# EAGLE design light_controller (EAGLE 8.5.0)
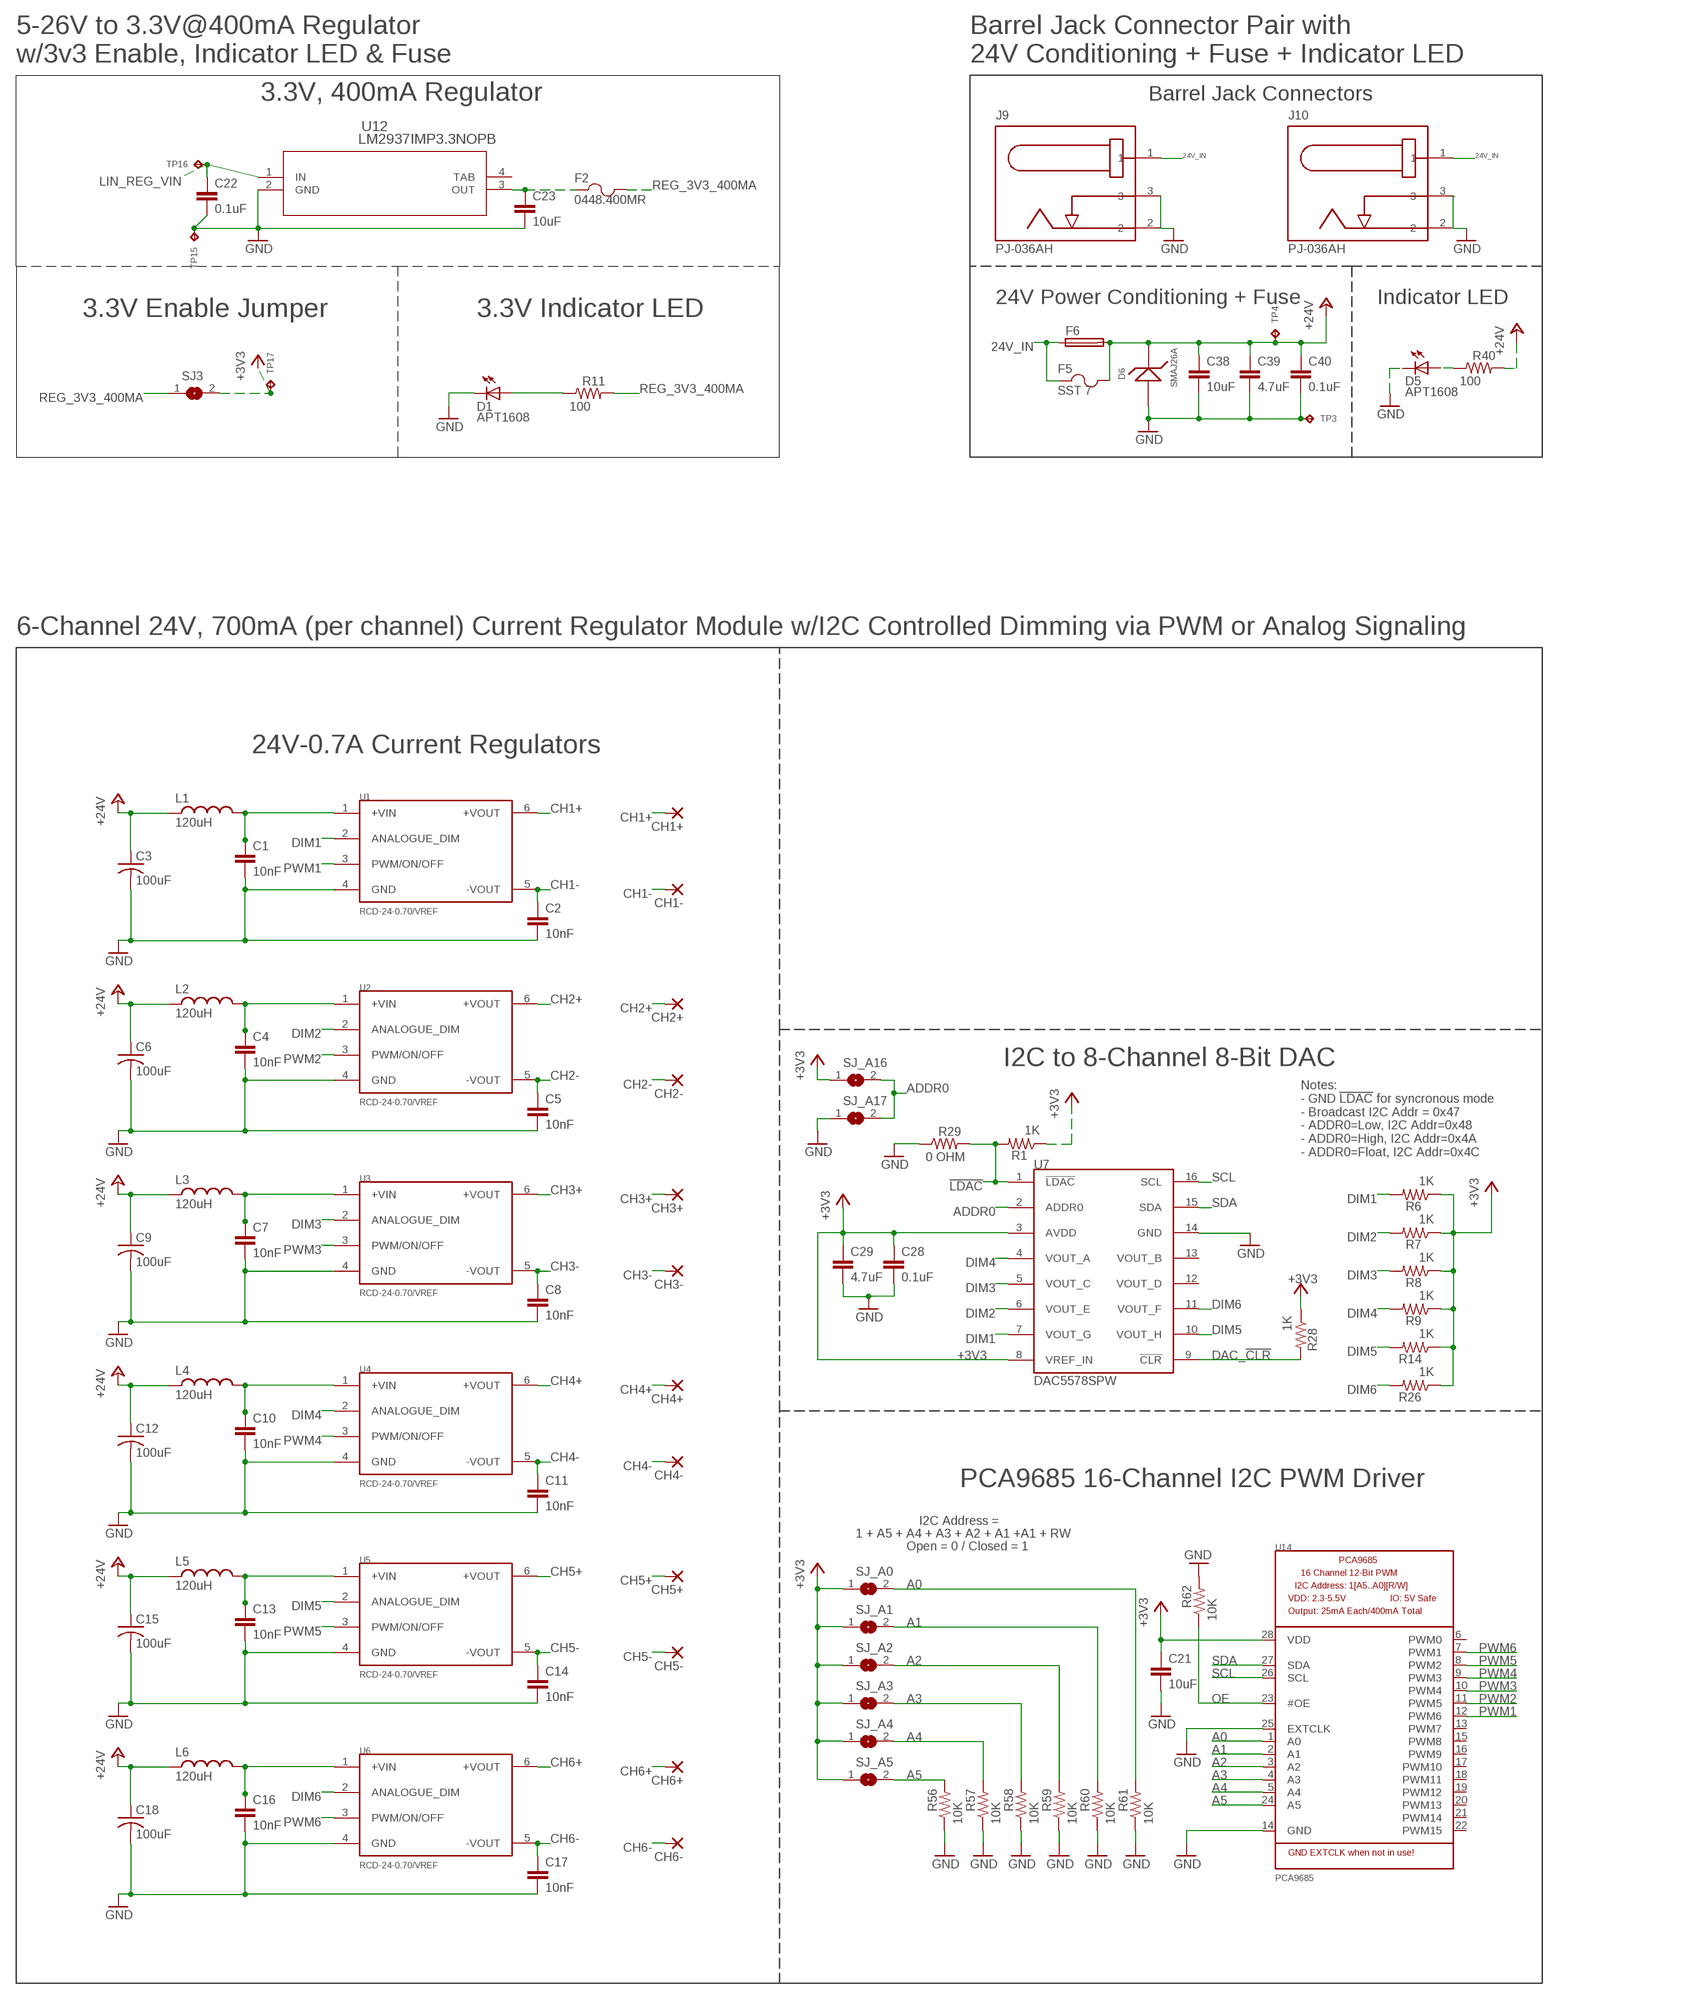
[diagram p0: schematic, sheet 1, part 1 of 2]
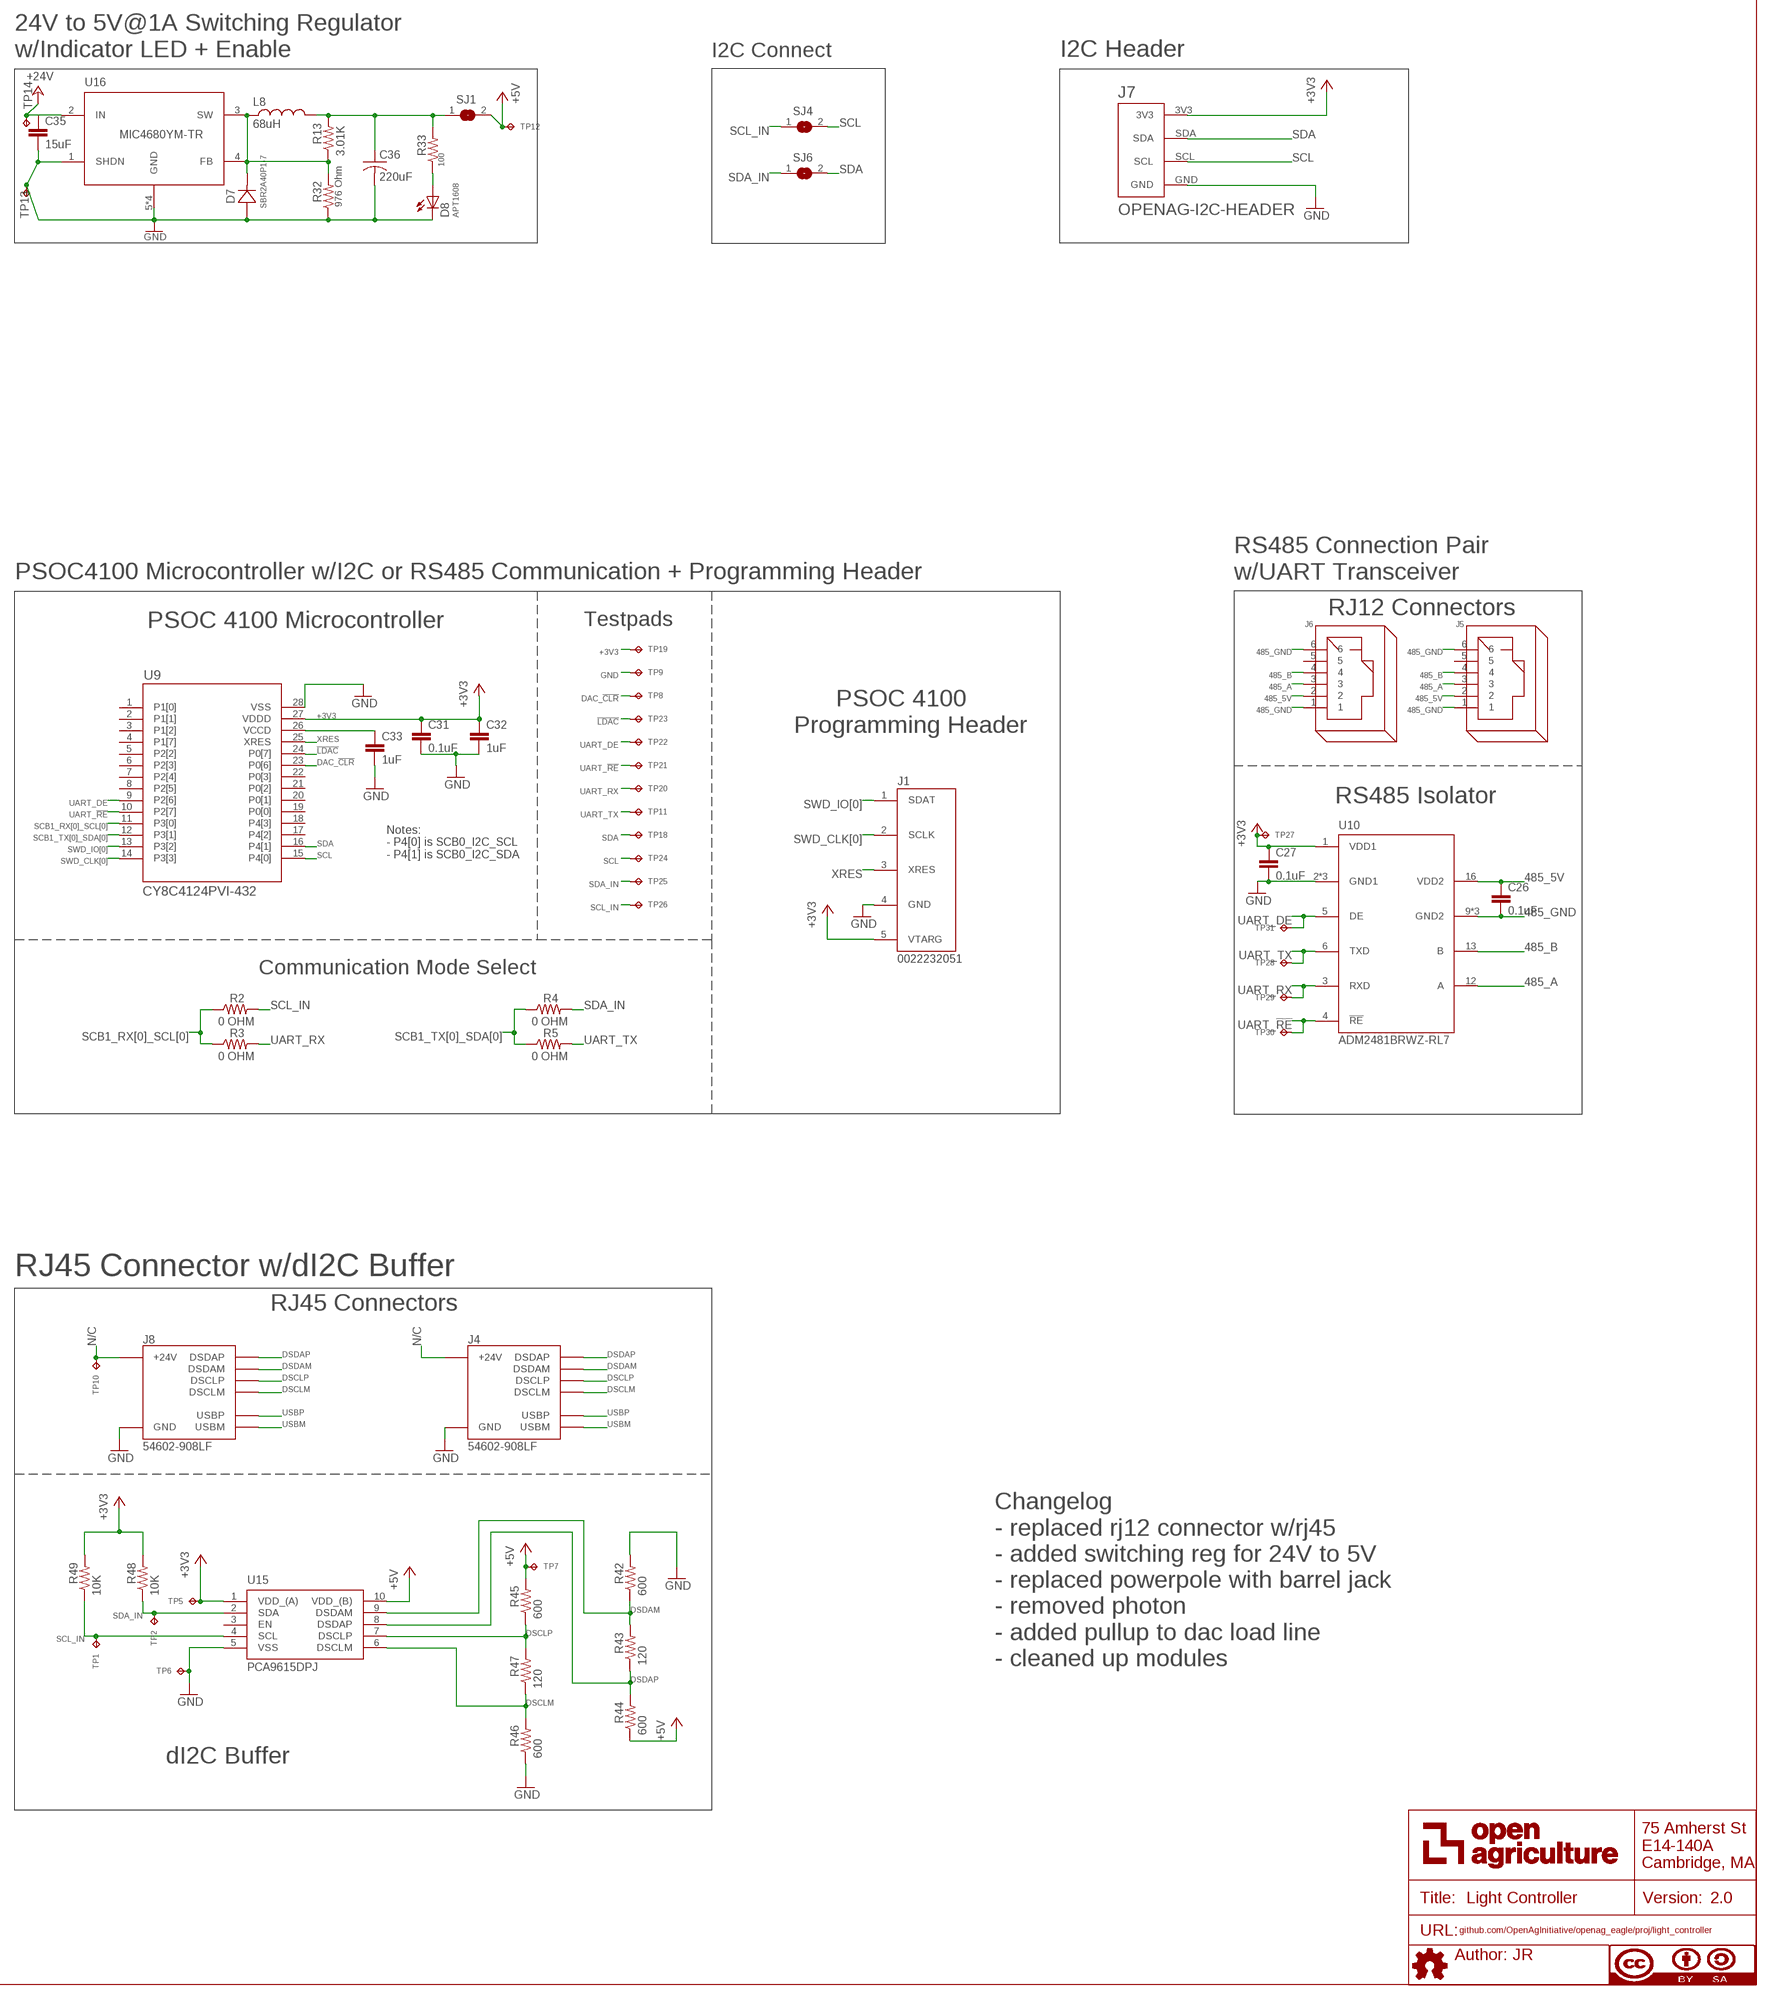
[diagram p1: schematic, sheet 1, part 2 of 2]

## Parts
C1  10nF  10NF-C0603C103K5RACTU  [C0603]
C2  10nF  10NF-C0603C103K5RACTU  [C0603]
C3  100uF  100UF-EEE-1HA101UP  [EEE-1HA101UP]
C4  10nF  10NF-C0603C103K5RACTU  [C0603]
C5  10nF  10NF-C0603C103K5RACTU  [C0603]
C6  100uF  100UF-EEE-1HA101UP  [EEE-1HA101UP]
C7  10nF  10NF-C0603C103K5RACTU  [C0603]
C8  10nF  10NF-C0603C103K5RACTU  [C0603]
C9  100uF  100UF-EEE-1HA101UP  [EEE-1HA101UP]
C10  10nF  10NF-C0603C103K5RACTU  [C0603]
C11  10nF  10NF-C0603C103K5RACTU  [C0603]
C12  100uF  100UF-EEE-1HA101UP  [EEE-1HA101UP]
C13  10nF  10NF-C0603C103K5RACTU  [C0603]
C14  10nF  10NF-C0603C103K5RACTU  [C0603]
C15  100uF  100UF-EEE-1HA101UP  [EEE-1HA101UP]
C16  10nF  10NF-C0603C103K5RACTU  [C0603]
C17  10nF  10NF-C0603C103K5RACTU  [C0603]
C18  100uF  100UF-EEE-1HA101UP  [EEE-1HA101UP]
C21  10uF  10UF-GMK212BBJ106KG-T  [C0805]
C22  0.1uF  0.1UF-C0603C104K5RACTU  [C0603]
C23  10uF  10UF-GMK212BBJ106KG-T  [C0805]
C26  0.1uF  0.1UF-C0603C104K5RACTU  [C0603]
C27  0.1uF  0.1UF-C0603C104K5RACTU  [C0603]
C28  0.1uF  0.1UF-C0603C104K5RACTU  [C0603]
C29  4.7uF  4.7UF-CL21A475KBQNNNE  [C0805]
C31  0.1uF  0.1UF-C0603C104K5RACTU  [C0603]
C32  1uF  1UF-CL10A105KB8NNNC  [C0603]
C33  1uF  1UF-CL10A105KB8NNNC  [C0603]
C35  15uF  15UF-C2012X5R1V156M125AC  [C0805]
C36  220uF  220UF-TPSY227K010R0100  [CT7343]
C38  10uF  10UF-GMK212BBJ106KG-T  [C0805]
C39  4.7uF  4.7UF-CL21A475KBQNNNE  [C0805]
C40  0.1uF  0.1UF-C0603C104K5RACTU  [C0603]
CH1+  3,17/1,3  [3,17/1,3]
CH1-  3,17/1,3  [3,17/1,3]
CH2+  3,17/1,3  [3,17/1,3]
CH2-  3,17/1,3  [3,17/1,3]
CH3+  3,17/1,3  [3,17/1,3]
CH3-  3,17/1,3  [3,17/1,3]
CH4+  3,17/1,3  [3,17/1,3]
CH4-  3,17/1,3  [3,17/1,3]
CH5+  3,17/1,3  [3,17/1,3]
CH5-  3,17/1,3  [3,17/1,3]
CH6+  3,17/1,3  [3,17/1,3]
CH6-  3,17/1,3  [3,17/1,3]
D1  APT1608  APT1608CGCK  [CHIPLED_0603]
D5  APT1608  APT1608CGCK  [CHIPLED_0603]
D6  SMAJ26A  SMAJ26A-13-F  [SMA]
D7  SBR2A40P1-7  [POWERDI123]
D8  APT1608  APT1608CGCK  [CHIPLED_0603]
F2  0448.400MR  0438.375WR  [0603]
F5  SST 7  SST_7  [SS]
F6  GSH15  [GSH15]
FRAME1  DOCFIELD  [DOCFIELD]
J1  0022232051  MINI-PROG3-5POS-MATING-CONNECTOR  [22-23-2051]
J4  54602-908LF  OPENAG-V1-RJ45PTH  [OPENAG-V1-RJ45]
J5  OPENAG-RS485-RJ12  [OPENAG-RS485-RJ12]
J6  OPENAG-RS485-RJ12  [OPENAG-RS485-RJ12]
J7  OPENAG-I2C-HEADER  [OPENAG-I2C-HEADER]
J8  54602-908LF  OPENAG-V1-RJ45PTH  [OPENAG-V1-RJ45]
J9  PJ-036AH  PJ-036AH-SMT-TR  [PJ-036AH]
J10  PJ-036AH  PJ-036AH-SMT-TR  [PJ-036AH]
L1  120uH  120UH-74404064121  [74404064121]
L2  120uH  120UH-74404064121  [74404064121]
L3  120uH  120UH-74404064121  [74404064121]
L4  120uH  120UH-74404064121  [74404064121]
L5  120uH  120UH-74404064121  [74404064121]
L6  120uH  120UH-74404064121  [74404064121]
L8  68uH  68UH-UP2B-680-R  [UP2B]
R1  1K  1K-ERJ-PB3D1001V  [RC0603N]
R2  0 OHM  0OHM-RC0603JR-070RL  [RC0603N]
R3  0 OHM  0OHM-RC0603JR-070RL  [RC0603N]
R4  0 OHM  0OHM-RC0603JR-070RL  [RC0603N]
R5  0 OHM  0OHM-RC0603JR-070RL  [RC0603N]
R6  1K  1K-ERJ-PB3D1001V  [RC0603N]
R7  1K  1K-ERJ-PB3D1001V  [RC0603N]
R8  1K  1K-ERJ-PB3D1001V  [RC0603N]
R9  1K  1K-ERJ-PB3D1001V  [RC0603N]
R11  100  100OHM-RC0603JR-07100RL  [RC0603N]
R13  3.01K  3.01K-RC0603FR-073K01L  [RC0603N]
R14  1K  1K-ERJ-PB3D1001V  [RC0603N]
R26  1K  1K-ERJ-PB3D1001V  [RC0603N]
R28  1K  1K-ERJ-PB3D1001V  [RC0603N]
R29  0 OHM  0OHM-RC0603JR-070RL  [RC0603N]
R32  976 Ohm  982OHM-RC0603FR-07976RL  [RC0603N]
R33  100  100OHM-RC0603JR-07100RL  [RC0603N]
R40  100  100OHM-RC0603JR-07100RL  [RC0603N]
R42  600  600OHM-RC0603FR-07604RL  [RC0603N]
R43  120  120OHM-RC0603FR-07120RL  [RC0603N]
R44  600  600OHM-RC0603FR-07604RL  [RC0603N]
R45  600  600OHM-RC0603FR-07604RL  [RC0603N]
R46  600  600OHM-RC0603FR-07604RL  [RC0603N]
R47  120  120OHM-RC0603FR-07120RL  [RC0603N]
R48  10K  10K-ERJ-3EKF1002V  [RC0603N]
R49  10K  10K-ERJ-3EKF1002V  [RC0603N]
R56  10K  10K-ERJ-3EKF1002V  [RC0603N]
R57  10K  10K-ERJ-3EKF1002V  [RC0603N]
R58  10K  10K-ERJ-3EKF1002V  [RC0603N]
R59  10K  10K-ERJ-3EKF1002V  [RC0603N]
R60  10K  10K-ERJ-3EKF1002V  [RC0603N]
R61  10K  10K-ERJ-3EKF1002V  [RC0603N]
R62  10K  10K-ERJ-3EKF1002V  [RC0603N]
SJ1  SOLDERJUMPERREFLOW_NOPASTE  [SOLDERJUMPER_REFLOW_NOPASTE]
SJ3  SOLDERJUMPERREFLOW_NOPASTE  [SOLDERJUMPER_REFLOW_NOPASTE]
SJ4  SOLDERJUMPERREFLOW_NOPASTE  [SOLDERJUMPER_REFLOW_NOPASTE]
SJ6  SOLDERJUMPERREFLOW_NOPASTE  [SOLDERJUMPER_REFLOW_NOPASTE]
SJ_A0  SOLDERJUMPERREFLOW_NOPASTE  [SOLDERJUMPER_REFLOW_NOPASTE]
SJ_A1  SOLDERJUMPERREFLOW_NOPASTE  [SOLDERJUMPER_REFLOW_NOPASTE]
SJ_A2  SOLDERJUMPERREFLOW_NOPASTE  [SOLDERJUMPER_REFLOW_NOPASTE]
SJ_A3  SOLDERJUMPERREFLOW_NOPASTE  [SOLDERJUMPER_REFLOW_NOPASTE]
SJ_A4  SOLDERJUMPERREFLOW_NOPASTE  [SOLDERJUMPER_REFLOW_NOPASTE]
SJ_A5  SOLDERJUMPERREFLOW_NOPASTE  [SOLDERJUMPER_REFLOW_NOPASTE]
SJ_A16  SOLDERJUMPERREFLOW_NOPASTE  [SOLDERJUMPER_REFLOW_NOPASTE]
SJ_A17  SOLDERJUMPERREFLOW_NOPASTE  [SOLDERJUMPER_REFLOW_NOPASTE]
TP1  TPTP06R  [TP06R]
TP2  TPTP06R  [TP06R]
TP3  TPTP06R  [TP06R]
TP4  TPTP06R  [TP06R]
TP5  TPTP06R  [TP06R]
TP6  TPTP06R  [TP06R]
TP7  TPTP06R  [TP06R]
TP8  TPTP04R  [TP04R]
TP9  TPTP04R  [TP04R]
TP10  TPTP06R  [TP06R]
TP11  TPTP04R  [TP04R]
TP12  TPTP06R  [TP06R]
TP13  TPTP06R  [TP06R]
TP14  TPTP06R  [TP06R]
TP15  TPTP06R  [TP06R]
TP16  TPTP06R  [TP06R]
TP17  TPTP06R  [TP06R]
TP18  TPTP04R  [TP04R]
TP19  TPTP04R  [TP04R]
TP20  TPTP04R  [TP04R]
TP21  TPTP04R  [TP04R]
TP22  TPTP04R  [TP04R]
TP23  TPTP04R  [TP04R]
TP24  TPTP04R  [TP04R]
TP25  TPTP04R  [TP04R]
TP26  TPTP04R  [TP04R]
TP27  TPTP04R  [TP04R]
TP28  TPTP04R  [TP04R]
TP29  TPTP04R  [TP04R]
TP30  TPTP04R  [TP04R]
TP31  TPTP04R  [TP04R]
U1  RCD-24-0.70/VREF  [RCD-24-PINNED]
U2  RCD-24-0.70/VREF  [RCD-24-PINNED]
U3  RCD-24-0.70/VREF  [RCD-24-PINNED]
U4  RCD-24-0.70/VREF  [RCD-24-PINNED]
U5  RCD-24-0.70/VREF  [RCD-24-PINNED]
U6  RCD-24-0.70/VREF  [RCD-24-PINNED]
U7  DAC5578SPW  [TSSOP16]
U9  CY8C4124PVI-432  [SSOP-28]
U10  ADM2481BRWZ-RL7  [SOIC16LWB]
U12  LM2937IMP3.3NOPB  LM2937IMP-3.3/NOPB  [MP04A]
U14  PCA9685  PCA9685PW/Q900,118  [TSSOP28]
U15  PCA9615DPJ  [SOP50P490X110-10N]
U16  MIC4680YM-TR  [SOIC8]

## Nets
24V_IN: F5.1 F6.1 J9.1 J10.1
485_5V: C26.1 J5.2 J6.2 U10.16(VDD2)
485_A: J5.3 J6.3 U10.12(A)
485_B: J5.4 J6.4 U10.13(B)
485_GND: C26.2 J5.1 J5.6 J6.1 J6.6 U10.9(GND2) U10.10(GND2) U10.15(GND2)
!LDAC!: R1.2 R29.2 TP23.1(TP) U7.1(!LDAC!) U9.24(P0[7])
+3V3: C21.1 C27.1 C28.1 C29.1 C31.1 C32.1 J1.5(VTARG) J7.3V3 R1.1 R6.1 R7.1 R8.1 R9.1 R14.1 R26.1 R28.1 R48.2 R49.2 SJ3.2 SJ_A0.1 SJ_A1.1 SJ_A2.1 SJ_A3.1 SJ_A4.1 SJ_A5.1 SJ_A16.1 TP5.TP TP17.TP TP19.1(TP) TP27.1(TP) U7.3(AVDD) U7.8(VREF_IN) U9.27(VDDD) U10.1(VDD1) U14.28(VDD) U15.1(VDD_(A))
+5V: R44.1 R45.2 SJ1.2 TP7.TP TP12.TP U15.10(VDD_(B))
+24V: C3.+(1(+)) C6.+(1(+)) C9.+(1(+)) C12.+(1(+)) C15.+(1(+)) C18.+(1(+)) C35.1 C38.1 C39.1 C40.1 D6.1 F5.2 F6.2 L1.1 L2.1 L3.1 L4.1 L5.1 L6.1 R40.2 TP4.TP TP14.TP U16.2(IN)
A0: R61.2 SJ_A0.2 U14.1(A0)
A1: R60.2 SJ_A1.2 U14.2(A1)
A2: R59.2 SJ_A2.2 U14.3(A2)
A3: R58.2 SJ_A3.2 U14.4(A3)
A4: R57.2 SJ_A4.2 U14.5(A4)
A5: R56.2 SJ_A5.2 U14.24(A5)
ADDR0: SJ_A16.2 SJ_A17.2 U7.2(ADDR0)
CH1+: CH1+.1(P) U1.6(+VOUT)
CH1-: C2.1 CH1-.1(P) U1.5(-VOUT)
CH2+: CH2+.1(P) U2.6(+VOUT)
CH2-: C5.1 CH2-.1(P) U2.5(-VOUT)
CH3+: CH3+.1(P) U3.6(+VOUT)
CH3-: C8.1 CH3-.1(P) U3.5(-VOUT)
CH4+: CH4+.1(P) U4.6(+VOUT)
CH4-: C11.1 CH4-.1(P) U4.5(-VOUT)
CH5+: CH5+.1(P) U5.6(+VOUT)
CH5-: C14.1 CH5-.1(P) U5.5(-VOUT)
CH6+: CH6+.1(P) U6.6(+VOUT)
CH6-: C17.1 CH6-.1(P) U6.5(-VOUT)
DAC_!CLR!: R28.2 TP8.1(TP) U7.9(!CLR!) U9.23(P0[6])
DIM1: R6.2 U1.2(ANALOGUE_DIM) U7.7(VOUT_G)
DIM2: R7.2 U2.2(ANALOGUE_DIM) U7.6(VOUT_E)
DIM3: R8.2 U3.2(ANALOGUE_DIM) U7.5(VOUT_C)
DIM4: R9.2 U4.2(ANALOGUE_DIM) U7.4(VOUT_A)
DIM5: R14.2 U5.2(ANALOGUE_DIM) U7.10(VOUT_H)
DIM6: R26.2 U6.2(ANALOGUE_DIM) U7.11(VOUT_F)
DSCLM: J4.DSCLM(5)(DSCLM) J8.DSCLM(5)(DSCLM) R46.2 R47.1 U15.6(DSCLM)
DSCLP: J4.DSCLP(4)(DSCLP) J8.DSCLP(4)(DSCLP) R45.1 R47.2 U15.7(DSCLP)
DSDAM: J4.DSDAM(2)(DSDAM) J8.DSDAM(2)(DSDAM) R42.1 R43.2 U15.9(DSDAM)
DSDAP: J4.DSDAP(1)(DSDAP) J8.DSDAP(1)(DSDAP) R43.1 R44.2 U15.8(DSDAP)
GND: C1.2 C2.2 C3.-(2(-)) C4.2 C5.2 C6.-(2(-)) C7.2 C8.2 C9.-(2(-)) C10.2 C11.2 C12.-(2(-)) C13.2 C14.2 C15.-(2(-)) C16.2 C17.2 C18.-(2(-)) C21.2 C22.2 C23.2 C27.2 C28.2 C29.2 C31.2 C32.2 C33.2 C35.2 C36.-(2(-)) C38.2 C39.2 C40.2 D1.C D5.C D6.2 D7.- D8.C J1.4(GND) J4.GND(3)(GND) J7.GND J8.GND(3)(GND) J9.2 J9.3 J10.2 J10.3 R29.1 R32.1 R42.2 R46.1 R56.1 R57.1 R58.1 R59.1 R60.1 R61.1 R62.2 SJ_A17.1 TP3.TP TP6.TP TP9.1(TP) TP13.TP TP15.TP U1.4(GND) U2.4(GND) U3.4(GND) U4.4(GND) U5.4(GND) U6.4(GND) U7.14(GND) U9.28(VSS) U10.2(GND1) U10.7(GND1) U10.8(GND1) U12.2(GND) U14.14(GND) U14.25(EXTCLK) U15.5(VSS) U16.1(SHDN) U16.5(GND) U16.6(GND) U16.7(GND) U16.8(GND)
LIN_REG_VIN: C22.1 TP16.TP U12.1(IN)
N$1: C1.1 L1.2 U1.1(+VIN)
N$2: C4.1 L2.2 U2.1(+VIN)
N$4: C7.1 L3.2 U3.1(+VIN)
N$5: C10.1 L4.2 U4.1(+VIN)
N$6: C13.1 L5.2 U5.1(+VIN)
N$7: C16.1 L6.2 U6.1(+VIN)
N$10: D1.A R11.1
N$11: D7.+ L8.1 R13.1 R32.2 U16.3(SW) U16.4(FB)
N$12: C23.1 F2.1 U12.3(OUT)
N$22: D8.A R33.1
N$23: C33.1 U9.26(VCCD)
N$24: C36.+(1(+)) L8.2 R13.2 R33.2 SJ1.1
N$26: D5.A R40.1
N/C: J4.24V(6)(+24V) J8.24V(6)(+24V) TP10.TP
OE: R62.1 U14.23(#OE)
PWM1: U1.3(PWM/ON/OFF) U14.12(PWM6)
PWM2: U2.3(PWM/ON/OFF) U14.11(PWM5)
PWM3: U3.3(PWM/ON/OFF) U14.10(PWM4)
PWM4: U4.3(PWM/ON/OFF) U14.9(PWM3)
PWM5: U5.3(PWM/ON/OFF) U14.8(PWM2)
PWM6: U6.3(PWM/ON/OFF) U14.7(PWM1)
REG_3V3_400MA: F2.2 R11.2 SJ3.1
SCB1_RX[0]_SCL[0]: R2.1 R3.1 U9.11(P3[0])
SCB1_TX[0]_SDA[0]: R4.1 R5.1 U9.12(P3[1])
SCL: J7.SCL SJ4.2 TP24.1(TP) U7.16(SCL) U9.15(P4[0]) U14.26(SCL)
SCL_IN: R2.2 R49.1 SJ4.1 TP1.TP TP26.1(TP) U15.4(SCL)
SDA: J7.SDA SJ6.2 TP18.1(TP) U7.15(SDA) U9.16(P4[1]) U14.27(SDA)
SDA_IN: R4.2 R48.1 SJ6.1 TP2.TP TP25.1(TP) U15.2(SDA)
SWD_CLK[0]: J1.2(SCLK) U9.14(P3[3])
SWD_IO[0]: J1.1(SDAT) U9.13(P3[2])
UART_!RE!: TP21.1(TP) TP30.1(TP) U9.10(P2[7]) U10.4(!RE!)
UART_DE: TP22.1(TP) TP31.1(TP) U9.9(P2[6]) U10.5(DE)
UART_RX: R3.2 TP20.1(TP) TP29.1(TP) U10.3(RXD)
UART_TX: R5.2 TP11.1(TP) TP28.1(TP) U10.6(TXD)
USBM: J4.USBM(8)(USBM) J8.USBM(8)(USBM)
USBP: J4.USBP(7)(USBP) J8.USBP(7)(USBP)
XRES: J1.3(XRES) U9.25(XRES)
Unconnected: J5.5 J6.5 U7.12(VOUT_D) U7.13(VOUT_B) U9.1(P1[0]) U9.2(P1[1]) U9.3(P1[2]) U9.4(P1[7]) U9.5(P2[2]) U9.6(P2[3]) U9.7(P2[4]) U9.8(P2[5]) U9.17(P4[2]) U9.18(P4[3]) U9.19(P0[0]) U9.20(P0[1]) U9.21(P0[2]) U9.22(P0[3]) U14.6(PWM0) U14.13(PWM7) U14.15(PWM8) U14.16(PWM9) U14.17(PWM10) U14.18(PWM11) U14.19(PWM12) U14.20(PWM13) U14.21(PWM14) U14.22(PWM15) U15.3(EN)

## Notes on the sheet
- 5-26V to 3.3V@400mA Regulator 
  w/3v3 Enable, Indicator LED & Fuse
- Barrel Jack Connector Pair with 
  24V Conditioning + Fuse + Indicator LED
- 24V to 5V@1A Switching Regulator
  w/Indicator LED + Enable
- I2C Connect | I2C Header
- 3.3V, 400mA Regulator | Barrel Jack Connectors
- 24V Power Conditioning + Fuse | Indicator LED
- 3.3V Enable Jumper | 3.3V Indicator LED
- 6-Channel 24V, 700mA (per channel) Current Regulator Module w/I2C Controlled Dimming via PWM or Analog Signaling | PSOC4100 Microcontroller w/I2C or RS485 Communication + Programming Header
- RS485 Connection Pair 
  w/UART Transceiver
- RJ12 Connectors
- PSOC 4100 Microcontroller | Testpads
- 24V-0.7A Current Regulators
- PSOC 4100 
  Programming Header
- RS485 Isolator
- Notes:
  - P4[0] is SCB0_I2C_SCL
  - P4[1] is SCB0_I2C_SDA
- I2C to 8-Channel 8-Bit DAC | Communication Mode Select
- Notes:
  - GND !LDAC! for syncronous mode
  - Broadcast I2C Addr = 0x47
  - ADDR0=Low, I2C Addr=0x48
  - ADDR0=High, I2C Addr=0x4A
  - ADDR0=Float, I2C Addr=0x4C
- RJ45 Connector w/dI2C Buffer
- RJ45 Connectors
- PCA9685 16-Channel I2C PWM Driver
- I2C Address =
- 1 + A5 + A4 + A3 + A2 + A1 +A1 + RW
- Open = 0 / Closed = 1
- Changelog
  - replaced rj12 connector w/rj45
  - added switching reg for 24V to 5V
  - replaced powerpole with barrel jack
  - removed photon
  - added pullup to dac load line
  - cleaned up modules
- dI2C Buffer

## Power pins joined to a net without a drawn wire
TAB: U12.4(TAB)

## Library data of the parts
C1 C2 C4 C5 C7 C8 C10 C11 C13 C14 C16 C17 = openag-capacitors:10NF-C0603C103K5RACTU: KEMET - C0603C103K5RACTU - CAP CER 10000PF 50V X7R 0603 Description: 10000pF ±10% 50V Ceramic Capacitor X7R 0603 (1608 Metric) Technical Specifications: Capacitance: 10000pF Tolerance: ±10% Voltage - Rated: 50V Temperature Coefficient: X7R Operating Temperature: -55°C ~ 125°C Applications: General Purpose Mounting Type: Surface Mount, MLCC Package / Case: 0603 (1608 Metric) Size / Dimension: 0.063" L x 0.032" W (1.60mm x 0.80mm) Thickness (Max): 0.034" (0.87mm) Datasheet(s): X7R Dielectric, 6.3-250 VDC <https://search.kemet.com/component-edge/download/datasheet/C0603C103K5RACTU.pdf> Vendor(s): Digikey: 399-1091-1-ND <https://www.digikey.com/product-detail/en/kemet/C0603C103K5RACTU/399-1091-1-ND/411366#>; POPULATE: YES; VERIFIED: NO
C3 C6 C9 C12 C15 C18 = openag-capacitors:100UF-EEE-1HA101UP: Panasonic - EEE-1HA101UP - ELECTROLYTIC CAP ALUM 100UF 20% 50V SMD Description: 100µF 50V Aluminum Electrolytic Capacitors Radial, Can - SMD 2000 Hrs @ 85°C Technical Specifications: Capacitance: 100uF Tolerance: ±20% Rated Voltage: 50V Polarization: Polar Operating Temperature: -40°C ~ 85°C Datasheet(s): S Series, Type V <https://industrial.panasonic.com/cdbs/www-data/pdf/RDE0000/ABA0000C1145.pdf> Vendor(s): Digikey: PCE3917CT-ND <https://www.digikey.com/product-detail/en/panasonic-electronic-components/EEE-1HA101UP/PCE3917CT-ND/766293>; POPULATE: YES; VERIFIED: NO
C21 C23 C38 = openag-capacitors:10UF-GMK212BBJ106KG-T: Taiyo Yuden - GMK212BBJ106KG-T - CAP CER 10UF 35V X5R 0805 Description: 10µF ±10% 35V Ceramic Capacitor X5R 0805 (2012 Metric) Technical Specifications: Capacitance: 10µF Tolerance: ±10% Rated Voltage: 35V Temperature Coefficient: X5R Operating Temperature: -55°C ~ 85°C Package / Case: 0805 (2012 Metric) Datasheet(s): GMK212BBJ106KG-T Spec <http://ds.yuden.co.jp/TYCOMPAS/ut/detail.do?productNo=GMK212BBJ106KG-T&fileName=GMK212BBJ106KG-T_SS&mode=specSheetDownload> Vendor(s): Digikey: 587-4893-1-ND <https://www.digikey.com/product-detail/en/taiyo-yuden/GMK212BBJ106KG-T/587-4893-1-ND/6563736>; POPULATE: YES; VERIFIED: NO
C22 C26-C28 C31 C40 = openag-capacitors:0.1UF-C0603C104K5RACTU: Kemet - C0603C104K5RACTU - CAP CER 0.1UF 50V X7R 0603 Description: 0.1µF ±10% 50V Ceramic Capacitor X7R 0603 (1608 Metric) Technical Specifications: Capacitance: 0.1µF Tolerance: ±10% Rated Voltage: 50V Temperature Coefficient: X7R Operating Temperature: -55°C ~ 125°C Package / Case: 0603 (1608 Metric) Datasheet(s): X7R Dielectric, 6.3-250 VDC <https://search.kemet.com/component-edge/download/datasheet/C0603C104K5RACTU.pdf> Vendor(s): Digikey: 399-5089-1-ND <https://www.digikey.com/product-detail/en/kemet/C0603C104K5RACTU/399-5089-1-ND/1465623>; POPULATE: YES; VERIFIED: NO
C29 C39 = openag-capacitors:4.7UF-CL21A475KBQNNNE: Samsung - CL21A475KBQNNNE - CAP CER 4.7UF 50V X5R 0805 Description: 4.7µF ±10% 50V Ceramic Capacitor X5R 0805 (2012 Metric) Technical Specifications: Capacitance: 4.7uF Tolerance: ±10% Rated Voltage: 50V Temperature Coefficient: X5R Operating Temperature: -55°C ~ 85°C Package/Case: 0805 (2012 Metric) Datasheet(s): CL21A475KBQNNNE Characteristics <http://www.samsungsem.com/kr/front/downloadcms.do?path=/kr/support/product-search/mlcc/__icsFiles/afieldfile/2014/11/05&fileName=C_CL21A475KBQNNNE.pdf> Vendor(s): Digikey: 1276-1248-1-ND <https://www.digikey.com/product-detail/en/samsung-electro-mechanics/CL21A475KBQNNNE/1276-1248-1-ND/3889334>; POPULATE: YES; VERIFIED: NO
C32 C33 = openag-capacitors:1UF-CL10A105KB8NNNC: Samsung - CL10A105KB8NNNC - CAP CER 1UF 50V X5R 0603 Description: 1µF ±10% 50V Ceramic Capacitor X5R 0603 (1608 Metric) Technical Specifications: Capacitance: 1µF Tolerance: ±10% Rated Voltage: 50V Temperature Coefficient: X5R Operating Temperature: -55°C ~ 85°C Packaging / Case: 0603 (1608 Metric) Datasheet(s): CL10A105KB8NNNC Spec <http://www.samsungsem.com/kr/support/product-search/mlcc/CL10A105KB8NNNC.jsp> Vendor(s): Digikey: 1276-1860-1-ND <https://www.digikey.com/product-detail/en/samsung-electro-mechanics-america-inc/CL10A105KB8NNNC/1276-1860-1-ND/3889946>; POPULATE: YES; VERIFIED: NO
C35 = openag-capacitors:15UF-C2012X5R1V156M125AC: TDK Corporation - C2012X5R1V156M125AC - CAP CER 15UF 35V X5R 0805 Description: 15µF ±20% 35V Ceramic Capacitor X5R 0805 (2012 Metric) Technical Specifications: Capacitance: 15µF Tolerance: ±20% Voltage - Rated: 35V Temperature Coefficient: X5R Operating Temperature: -55°C ~ 85°C Features: Low ESL Applications: General Purpose Mounting Type: Surface Mount, MLCC Package / Case: 0805 (2012 Metric) Size / Dimension: 0.079" L x 0.049" W (2.00mm x 1.25mm) Thickness (Max): 0.057" (1.45mm) Datasheet(s): C Series, General Datasheet <https://product.tdk.com/info/en/catalog/datasheets/mlcc_commercial_general_en.pdf> MLCC Part Number Guide <https://product.tdk.com/en/products/common/pdf/mlcc_partnumber_description.pdf> C Series, Gen Appl & Mid-Voltage Spec <https://product.tdk.com/info/en/catalog/spec/mlccspec_commercial_general_midvoltage_en.pdf> Vendor(s): Digikey: 445-14423-1-ND <https://www.digikey.com/product-detail/en/tdk-corporation/C2012X5R1V156M125AC/445-14423-1-ND/3956089>
C36 = openag-capacitors:220UF-TPSY227K010R0100: AVX Corporation - TPSY227K010R0100 - CAP TANT 220UF 10V 10% 2917 Description: 220µF Molded Tantalum Capacitors 10V 2917 (7343 Metric) 100 mOhm Technical Specifications: Capacitance: 220µF Tolerance: ±10% Voltage - Rated: 10V Type: Molded ESR (Equivalent Series Resistance): 100 mOhm Operating Temperature: -55°C ~ 125°C Mounting Type: Surface Mount Package / Case: 2917 (7343 Metric) Size / Dimension: 0.287" L x 0.169" W (7.30mm x 4.30mm) Height - Seated (Max): 0.079" (2.00mm) Manufacturer Size Code: Y Features: General Purpose Datasheet(s): TPS Series, Low ESR <http://datasheets.avx.com/TPS.pdf> Vendor(s): Digikey: 478-5408-1-ND <https://www.digikey.com/scripts/DkSearch/dksus.dll?Detail&itemSeq=250948888&uq=636531796868737363>
CH1+ CH1- CH2+ CH2- CH3+ CH3- CH4+ CH4- CH5+ CH5- CH6+ CH6- = openag-wirepads:3,17/1,3: THROUGH-HOLE PAD
D1 D5 D8 = openag-diodes:APT1608CGCK: Kingbright - APT1608CGCK - LED GREEN CLEAR 0603 SMD Description: Green 570nm LED Indication - Discrete 2.1V 0603 (1608 Metric) Technical Specifications: Color: Green Lens Color: Colorless Lens Transparency: Clear Millicandela Rating: 50mcd Lens Style/Size: Rectangle with Flat Top, 1.20mm x 0.80mm Voltage - Forward (Vf) (Typ): 2.1V Current - Test: 20mA Viewing Angle: 120° Mounting Type: Surface Mount Wavelength - Dominant: 570nm Wavelength - Peak: 574nm Package / Case: 0603 (1608 Metric) Supplier Device Package: Chip LED Size / Dimension: 1.60mm L x 0.80mm W Height (Max): 0.75mm Datasheet(s): APT1608CGCK <http://www.kingbrightusa.com/images/catalog/SPEC/APT1608CGCK.pdf> Vendor(s): Digikey: 754-1116-1-ND <https://www.digikey.com/product-detail/en/kingbright/APT1608CGCK/754-1116-1-ND/1747833#>; POPULATE: YES; VERIFIED: NO
D6 = openag-diodes:SMAJ26A-13-F: Diodes Incorporated - SMAJ26A-13-F - TVS DIODE 26VWM 42.1VC SMA Description: TVS DIODE 26VWM 42.1VC SMA Technical Specifications: Type: Zener Voltage - Reverse Standoff (Typ): 26V Voltage - Breakdown (Min): 28.9V Voltage - Clamping (Max) @ Ipp: 42.1V Current - Peak Pulse (10/1000µs): 9.5A Power - Peak Pulse: 400W Power Line Protection: No Operating Temperature: -55°C ~ 150°C (TJ) DO-214AC, SMA Datasheet(s): SMAJ5.0(C)A - SMAJ200(C)A Vendor(s): Digikey: SMAJ26A-FDICT-ND <https://www.digikey.com/product-detail/en/diodes-incorporated/SMAJ26A-13-F/SMAJ26A-FDICT-ND/806583>
D7 = openag-diodes:SBR2A40P1-7: Diodes Incorporated - SBR2A40P1-7 - DIODE SBR 40V 2A POWERDI123 Description: Diode Super Barrier 40V 2A Surface Mount PowerDI™ 123 Technical Specifications: Diode Type: Super Barrier Voltage - DC Reverse (Vr) (Max): 40V Current - Average Rectified (Io): 2A Voltage - Forward (Vf) (Max) @ If: 500mV @ 2A Speed: Standard Recovery >500ns, > 200mA (Io) Current - Reverse Leakage @ Vr: 100µA @ 40V Mounting Type: Surface Mount Package / Case: POWERDI®123 Supplier Device Package: PowerDI™ 123 Operating Temperature - Junction: -65°C ~ 150°C Base Part Number: SBR2A40 Datasheet(s): SBR2A40P1 <https://www.diodes.com/assets/Datasheets/SBR2A40P1.pdf> Vendor(s): Digikey: SBR2A40P1DITR-ND <https://www.digikey.com/product-detail/en/diodes-incorporated/SBR2A40P1-7/SBR2A40P1DITR-ND/1681825>
F2 = openag-fuses:0438.375WR: Littelfuse Inc. - 0448.400MR - FUSE BOARD MNT 400MA 125VAC/VDC Description: FUSE BOARD MNT 400MA 125VAC/VDC Technical Specifications: Fuse Type: Board Mount (Cartridge Style Excluded) Current Rating: 400mA Voltage Rating - AC: 125V Voltage Rating - DC: 125V Response Time: Fast Package / Case: 2-SMD, Square End Block Mounting Type: Surface Mount Breaking Capacity @ Rated Voltage: 50A Melting I²t: 0.0416 Approvals: CSA, UL Operating Temperature: -55°C ~ 125°C Size / Dimension: 0.240" L x 0.106" W x 0.106" H (6.10mm x 2.69mm x 2.69mm) DC Cold Resistance: 0.4895 Ohms Datasheet(s): 448 Series Datasheet <http://www.littelfuse.com/~/media/electronics/datasheets/fuses/littelfuse_fuse_448_datasheet.pdf.pdf> Vendor(s): Digikey: F5573CT-ND <https://www.digikey.com/product-detail/en/littelfuse-inc/0448.400MR/F5573CT-ND/3306934>; POPULATE: YES; VERIFIED: YES
F5 = openag-fuses:SST_7: Bel Fuse - SST7 - FUSE BRD MNT 7A 125VAC/VDC 2SMD Description: FUSE BRD MNT 7A 125VAC/VDC 2SMD Technical Specifications: Current Rating: 7A Voltage Rating: 125V Fuse Type: Board Mount (Cartridge Style Excluded) Mounting Type: Surface Mount Operating Temperature: -55°C ~ 125°C Datasheet(s): SST Type <https://belfuse.com/resources/StewartConnector/SST.pdf> Vendor(s): Digikey: 507-1072-1-ND <https://www.digikey.com/product-detail/en/bel-fuse-inc/SST-7/507-1072-1-ND/615026>; POPULATE: YES; VERIFIED: NO
F6 = fuse:GSH15: FUSE HOLDER grid 15mm, 19649 Wickmann; MPN: 64900001039; OC_FARNELL: 1271673; OC_NEWARK: 02P0318
FRAME1 = openag-frames:DOCFIELD: DOCUMENT FIELD; AUTHOR: JR; DESCRIPTION: Controls 6 channels of 24V, 700mA for LED strings that can be interfaced via i2c, rs485, and/or wifi.; TITLE: Light Controller; URL: github.com/OpenAgInitiative/openag_eagle/proj/light_controller; VER: 2.0
J1 = openag-connectors:MINI-PROG3-5POS-MATING-CONNECTOR: Molex - 0022232051 - CONN HEADER 5POS .100 VERT TIN Description: 5 Positions Header Connector 0.100" (2.54mm) Through Hole Tin This is the specified mating connector for programming a PSOC microcontroller with the MiniProg3 Programmer Technical Specifications: Connector Type: Header Contact Type: Male Pin Pitch - Mating: 0.100" (2.54mm) Number of Positions: 5 Number of Rows: 1 Mounting Type: Through Hole Fastening Type: Friction Lock Datasheet(s): Molex 22-23-2051 <http://www.molex.com/pdm_docs/sd/022232051_sd.pdf> Cypress CY8CKIT-002 Brief <http://www.cypress.com/file/44091/download> Vendor(s): Digikey: WM4203-ND (Molex Connector) <https://www.digikey.com/products/en?keywords=22-23-2051> Digikey: 428-2975-ND (Cypress Programmer Kit) <https://www.digikey.com/product-detail/en/cypress-semiconductor-corp/CY8CKIT-002/428-2975-ND/2126344>; POPULATE: YES; VERIFIED: NO
J4 J8 = openag_connector:OPENAG-V1-RJ45: Amphenol FCI - 54602-908LF - CONN MOD JACK 8P8C R/A UNSHLD Description: Jack Modular Connector 8p8c (RJ45, Ethernet) 90� Angle (Right) Unshielded Cat3 Technical Specifications: Connector Type: Jack Number of Positions/Contacts: 8p8c (RJ45, Ethernet) Number of Ports: 1 Number of Rows: 1 Mounting Type: Through Hole Orientation: 90� Angle (Right) Termination: Solder Shielding: Unshielded Ratings: Cat3 Features: Board Lock LED Color: Does Not Contain LED Tab Direction: Down Contact Material: Copper Alloy Contact Finish: Gold Contact Finish Thickness: 15�in (0.38�m) Housing Material: Polyester, Glass Filled Operating Temperature: -40�C ~ 70�C Datasheet(s): 54601-x04(zzz)WPLF Drawing <http://cdn.amphenol-icc.com/media/wysiwyg/files/drawing/c-bmj-0102.pdf> Vendor(s): Digikey: 609-1046-ND <https://www.digikey.com/product-detail/en/amphenol-fci/54602-908LF/609-1046-ND/1001360>; POPULATE: YES; VERIFIED: NO
J5 J6 = openag-connectors:OPENAG-RS485-RJ12: Assmann WSW Components - A-2004-1-4-LP-N-R - RJ12 CONN MOD JACK 6P6C R/A UNSHLD Description: Jack Modular Connector 6p6c (RJ11, RJ12, RJ14, RJ25) 90° Angle (Right) Unshielded Technical Specifications: Connector Type: Jack Number of Positions/Contacts: 6p6c (RJ11, RJ12, RJ14, RJ25) Number of Ports: 1 Number of Rows: 1 Mounting Type: Through Hole Orientation: 90° Angle (Right) Termination: Solder Shielding: Unshielded Features: Board Lock LED Color: Does Not Contain LED Tab Direction: Down Contact Material: Phosphor Bronze Contact Finish: Gold Contact Finish Thickness: 6µin (0.152µm) Housing Material: Polybutylene Terephthalate (PBT), Glass Filled Operating Temperature: -40°C ~ 85°C Datasheet(s): A-2004-1-4-LP-N Drawing <http://www.assmann-wsw.com/fileadmin/datasheets/ASS_7320_CO.pdf> Vendor(s): Digikey: AE10383-ND <https://www.digikey.com/product-detail/en/assmann-wsw-components/A-2004-1-4-LP-N-R/AE10383-ND/2183634>
J7 = openag-connectors:OPENAG-I2C-HEADER: Fits standard 100 mil header footprint; POPULATE: NO; VERIFIED: NO
J9 J10 = openag-connectors:PJ-036AH-SMT-TR: CUI Inc. - PJ-036AH-SMT-TR - CONN PWR JACK 2X5.5MM SOLDER Description: Power Barrel Connector Jack 2.10mm ID (0.083"), 5.50mm OD (0.217") Surface Mount, Right Angle Technical Specifications: Connector Type: Jack Gender: Male Industry Recognized Mating Diameter: 2.10mm ID (0.083"), 5.50mm OD (0.217") Actual Diameter: 0.078" (2.00mm ID), 0.248" (6.30mm OD) Number of Positions/Contacts: 2 Conductors, 3 Contacts Internal Switch(s): Single Switch, Normally Closed Mounting Type: Surface Mount, Right Angle Termination: Solder Shielding: Unshielded Voltage - Rated: 24VDC Current Rating: 5A Mating Length/Depth: 0.360" (9.15mm) Contact Material - Plating: Silver Operating Temperature: -25°C ~ 85°C Housing Material: Polyamide (PA6T), Nylon 6T Contact Material: Brass; Copper Alloy Body Color: Black Datasheet(s): PJ-036AH-SMT-TR <http://www.cui.com/product/resource/digikeypdf/pj-036ah-smt-tr.pdf> Vendor(s): Digikey: CP-036AHPJCT-ND <https://www.digikey.com/product-detail/en/cui-inc/PJ-036AH-SMT-TR/CP-036AHPJCT-ND/1530994>
L1-L6 = openag-inductors:120UH-74404064121: Wurth Electronics - 74404064121 - FIXED IND 120UH 790MA 520 MOHM Technical Specifications: Inductance: 120uH Rated Current: 790mA Saturation Current: 980mA DC Resistance: 520mΩ Operating Temperature: -40° C to 125°C Datasheet(s): 74404064121 Drawing <http://katalog.we-online.de/pbs/datasheet/74404064121.pdf> Vendors: Digikey: 732-7258-1-ND <https://www.digikey.com/product-detail/en/wurth-electronics-inc/74404064121/732-7258-1-ND/5353238>; POPULATE: YES; VERIFIED: NO
L8 = openag-inductors:68UH-UP2B-680-R: Eaton - UP2B-680-R - FIXED IND 68UH 1.5A 178.7 MOHM Description: 68µH Unshielded Wirewound Inductor 1.5A 178.7 mOhm Max Nonstandard Technical Specifications: Type: Wirewound Material - Core: Ferrite Inductance: 68µH Tolerance: ±20% Current Rating: 1.5A Current - Saturation: 1.2A Shielding: Unshielded DC Resistance (DCR): 178.7 mOhm Max Operating Temperature: -40°C ~ 85°C Frequency - Test: 100kHz Mounting Type: Surface Mount Package / Case: Nonstandard Size / Dimension: 0.550" L x 0.410" W (13.97mm x 10.41mm) Height - Seated (Max): 0.236" (6.00mm) Datasheet(s): UNI-PAC (-R) <http://www.cooperindustries.com/content/dam/public/bussmann/Electronics/Resources/product-datasheets/BUS_Elx_PM_4308_UNI_PAC_Power_Inductors.pdf> Vendor(s): Digikey: 513-1083-1-ND <https://www.digikey.com/scripts/DkSearch/dksus.dll?Detail&itemSeq=250945518&uq=636531821133403587>
R1 R6-R9 R14 R26 R28 = openag-resistors:1K-ERJ-PB3D1001V: Panasonic - P20283CT-ND - RES SMD 1K OHM 0.5% 1/5W 0603 Description: 1 kOhms ±0.5% 0.2W, 1/5W Chip Resistor 0603 (1608 Metric) Automotive AEC-Q200, Pulse Withstanding Thick Film Technical Specifications: Resistance: 1 kOhms Tolerance: ±0.5% Power: 0.2W, 1/5W Operating Temperature: -55°C ~ 155°C Package / Case: 0603 (1608 Metric) Datasheet(s): ERJ-PB3, PB6 Series, High Precision Datasheet <https://industrial.panasonic.com/cdbs/www-data/pdf/RDM0000/AOA0000C328.pdf> Vendor(s): Digikey: P20283CT-ND <https://www.digikey.com/product-detail/en/panasonic-electronic-components/ERJ-PB3D1001V/P20283CT-ND/6214538>; POPULATE: YES; VERIFIED: NO
R2-R5 R29 = openag-resistors:0OHM-RC0603JR-070RL: Yageo - RC0603JR-070RL - RES SMD 0 OHM JUMPER 1/10W 0603 Description: 0 Ohms Jumper 0.1W, 1/10W Chip Resistor 0603 (1608 Metric) Moisture Resistant Thick Film Technical Specifications: Resistance: 0 Ohms Power: 0.1W, 1/10W Operating Temperature: -55°C ~ 155°C Package / Case: 0603 (1608 Metric) Datasheet(s): RC Series, L Datasheet <http://www.yageo.com/documents/recent/PYu-RC_Group_51_RoHS_L_8.pdf> Vendor(s): Digikey: 311-0.0GRCT-ND <https://www.digikey.com/product-detail/en/yageo/RC0603JR-070RL/311-0.0GRCT-ND/729622>; POPULATE: YES; VERIFIED: NO
R11 R33 R40 = openag-resistors:100OHM-RC0603JR-07100RL: Yageo - RC0603JR-07100RL - RES SMD 100 OHM 5% 1/10W 0603 Description: 100 Ohms ±5% 0.1W, 1/10W Chip Resistor 0603 (1608 Metric) Moisture Resistant Thick Film Technical Specifications: Resistance: 100 Ohms Tolerance: ±5% Power (Watts): 0.1W, 1/10W Composition: Thick Film Features: Moisture Resistant Temperature Coefficient: ±100ppm/°C Operating Temperature: -55°C ~ 155°C Package / Case: 0603 (1608 Metric) Supplier Device Package: 0603 Size / Dimension: 0.063" L x 0.032" W (1.60mm x 0.80mm) Height - Seated (Max): 0.022" (0.55mm) Number of Terminations: 2 Datasheet(s): Thick Film Chip Resistor Intro <http://www.yageo.com.tw/exep/pages/download/literatures/PYu-R_INT-thick_7.pdf> Chip Resistor Marking <http://www.yageo.com/exep/pages/download/literatures/PYu-R_Marking_2.pdf> RC Series, L Datasheet <http://www.yageo.com/documents/recent/PYu-RC_Group_51_RoHS_L_8.pdf> Vendor(s): Digikey: 311-100GRCT-ND <https://www.digikey.com/product-detail/en/yageo/RC0603JR-07100RL/311-100GRCT-ND/729644>; POPULATE: YES; VERIFIED: NO
R13 = openag-resistors:3.01K-RC0603FR-073K01L: Yageo - RC0603FR-073K01L - RES SMD 3.01K OHM 1% 1/10W 0603 Description: 3.01 kOhms ±1% 0.1W, 1/10W Chip Resistor 0603 (1608 Metric) Moisture Resistant Thick Film Technical Specifications: Resistance: 3.01 kOhms Tolerance: ±1% Power (Watts): 0.1W, 1/10W Composition: Thick Film Features: Moisture Resistant Temperature Coefficient: ±100ppm/°C Operating Temperature: -55°C ~ 155°C Package / Case: 0603 (1608 Metric) Supplier Device Package: 0603 Size / Dimension: 0.063" L x 0.032" W (1.60mm x 0.80mm) Height - Seated (Max): 0.022" (0.55mm) Number of Terminations: 2 Datasheet(s): Chip Resistor Marking <http://www.yageo.com/exep/pages/download/literatures/PYu-R_Marking_2.pdf> RC Series, L Datasheet <http://www.yageo.com/documents/recent/PYu-RC_Group_51_RoHS_L_8.pdf> Vendor(s): Digikey: 311-3.01KHRCT-ND <https://www.digikey.com/scripts/DkSearch/dksus.dll?Detail&itemSeq=250949714&uq=636531832410541188>
R32 = openag-resistors:982OHM-RC0603FR-07976RL: Yageo - RC0603FR-07976RL - RES SMD 976 OHM 1% 1/10W 0603 Description: 976 Ohms ±1% 0.1W, 1/10W Chip Resistor 0603 (1608 Metric) Moisture Resistant Thick Film Technical Specifications: Resistance: 976 Ohms Tolerance: ±1% Power (Watts): 0.1W, 1/10W Composition: Thick Film Features: Moisture Resistant Temperature Coefficient: ±100ppm/°C Operating Temperature: -55°C ~ 155°C Package / Case: 0603 (1608 Metric) Supplier Device Package: 0603 Size / Dimension: 0.063" L x 0.032" W (1.60mm x 0.80mm) Height - Seated (Max): 0.022" (0.55mm) Number of Terminations: 2 Datasheet(s): Chip Resistor Marking <http://www.yageo.com/exep/pages/download/literatures/PYu-R_Marking_2.pdf> RC Series, L Datasheet <http://www.yageo.com/documents/recent/PYu-RC_Group_51_RoHS_L_8.pdf> Vendor(s): Digikey: 311-976HRCT-ND <https://www.digikey.com/scripts/DkSearch/dksus.dll?Detail&itemSeq=250949870&uq=636531835229553061>
R42 R44-R46 = openag-resistors:600OHM-RC0603FR-07604RL: Yageo - RC0603FR-07604RL - RES SMD 604 OHM 1% 1/10W 0603 Description: 604 Ohms ±1% 0.1W, 1/10W Chip Resistor 0603 (1608 Metric) Moisture Resistant Thick Film Technical Specifications: Resistance: 604 Ohms Tolerance: ±1% Power (Watts): 0.1W, 1/10W Composition: Thick Film Features: Moisture Resistant Temperature Coefficient: ±100ppm/°C Operating Temperature: -55°C ~ 155°C Package / Case: 0603 (1608 Metric) Supplier Device Package: 0603 Size / Dimension: 0.063" L x 0.032" W (1.60mm x 0.80mm) Height - Seated (Max): 0.022" (0.55mm) Number of Terminations: 2 Datasheet(s): RC Series, L Datasheet <http://www.yageo.com/documents/recent/PYu-RC_Group_51_RoHS_L_8.pdf> Chip Resistor Marking <http://www.yageo.com/exep/pages/download/literatures/PYu-R_Marking_2.pdf> Vendor(s): Digikey: 311-604HRCT-ND <https://www.digikey.com/product-detail/en/yageo/RC0603FR-07604RL/311-604HRCT-ND/730276>
R43 R47 = openag-resistors:120OHM-RC0603FR-07120RL: Yageo - RC0603FR-07120RL - RES SMD 120 OHM 1% 1/10W 0603 Description: 120 Ohms ±1% 0.1W, 1/10W Chip Resistor 0603 (1608 Metric) Moisture Resistant Thick Film Technical Specifications: Resistance: 120 Ohms Tolerance: ±1% Power (Watts): 0.1W, 1/10W Composition: Thick Film Features: Moisture Resistant Temperature Coefficient: ±100ppm/°C Operating Temperature: -55°C ~ 155°C Package / Case: 0603 (1608 Metric) Supplier Device Package: 0603 Size / Dimension: 0.063" L x 0.032" W (1.60mm x 0.80mm) Height - Seated (Max): 0.022" (0.55mm) Number of Terminations: 2 Datasheet(s): RC Series, L Datasheet <http://www.yageo.com/documents/recent/PYu-RC_Group_51_RoHS_L_8.pdf> Chip Resistor Marking <http://www.yageo.com/exep/pages/download/literatures/PYu-R_Marking_2.pdf> Vendor(s): Digikey: 311-120HRCT-ND <https://www.digikey.com/product-detail/en/yageo/RC0603FR-07120RL/311-120HRCT-ND/729867>
R48 R49 R56-R62 = openag-resistors:10K-ERJ-3EKF1002V: Panasonic - ERJ-3EKF1002V - RES SMD 10K OHM 1% 1/10W 0603 Description: 10 kOhms ±1% 0.1W, 1/10W Chip Resistor 0603 (1608 Metric) Automotive AEC-Q200 Thick Film Technical Specifications: Resistance: 10kOhms Tolerance: ±1% Power: 0.1W, 1/10W Operating Temperature: -55°C ~ 155°C Package/Case: 0603 (1608 Metric) Datasheet(s): ERJ-3EKF1002V View All Specifications <https://industrial.panasonic.com/ww/products/resistors/chip-resistors/general-purpose-chip-resistors/precision-thick-film-chip-resistors/ERJ3EKF1002V> Vendor(s): Digikey: P10.0KHCT-ND <https://www.digikey.com/product-detail/en/panasonic-electronic-components/ERJ-3EKF1002V/P10.0KHCT-ND/198102>; POPULATE: YES; VERIFIED: NO
SJ1 SJ3 SJ4 SJ6 SJ_A0 SJ_A1-SJ_A5 SJ_A16 SJ_A17 = openag-connectors:SOLDERJUMPER: SMD Solder JUMPER Solder the two pads together to create a connection, or remove the solder to break it. REFLOW - Use this footprint for solder paste and reflow ovens. WAVE - Use this footprint for hand-soldering (larger pads). CLOSED - Has a trace between the two pads to ensure it is closed by default. The trace needs to be cut to disable the jumper, and can be closed again by creating a solder bridge between the two pads.; POPULATE: YES; VERIFIED: NO
TP1-TP31 = openag-testpads:TP: Test pad
U1-U6 = openag-regulators:RCD-24-0.70/VREF: Recom Power - RCD-24-0.70/VREF - LED SUPPLY CC BUCK 2-35V 700MA Description: 700mA 2 ~ 35 V Constant Current LED Driver Buck Topology 1 Output Technical Specifications: Type: Constant Current Topology: Buck Number of Outputs: 1 Voltage - Input (Min): 4.5V Voltage - Input (Max): 36V Voltage - Output: 2 ~ 35 V Current - Output (Max): 700mA Power (Watts): 25W Dimming: Analog Features: SCP Operating Temperature: -40°C ~ 71°C Efficiency: 96% Mounting Type: Through Hole Package / Case: 6-DIP Module Size / Dimension: 0.87" L x 0.49" W x 0.33" H (22.1mm x 12.6mm x 8.5mm) Approvals: cULus Weight: 0.01 lb (4.54g) Datasheet(s): RCD-24 Series Datasheet <https://www.recom-power.com/pdf/Lightline/RCD-24.pdf> Vendor(s): Digikey: 945-1806-5-ND <https://www.digikey.com/product-detail/en/recom-power/RCD-24-0.70-VREF/945-1806-5-ND/2613767>; POPULATE: YES; VERIFIED: NO
U7 = openag-dacs:DAC5578SPW: Texas Instruments - DAC5578SPW Description: 8 Bit Digital to Analog Converter 8 16-TSSOP Technical Specifications: Number of Bits: 8-bit Number of D/A Converters: 8 Settling Time: 12us Operating Voltage: 2.7V - 5.5V Operating Temperature: -40° C to 125°C Max IDD (Normal Mode): 1.4mA Output Short Circuit Current (Individual): 25mA Datasheet(s): DAC5578,6578,7578 <http://www.ti.com/lit/ds/symlink/dac5578.pdf> Vendor(s): Digikey: 296-27736-5-ND <https://www.digikey.com/product-detail/en/texas-instruments/DAC5578SPW/296-27736-5-ND/2360827>; POPULATE: YES; VERIFIED: NO
U9 = openag-microcontrollers:CY8C4124PVI-432: Cypress - CY8C4124PVI-432 - IC MCU 32BIT 16KB FLASH 28SSOP Description: ARM® Cortex®-M0 PSOC® 4 CY8C41xx Microcontroller IC 32-Bit 24MHz 16KB (16K x 8) FLASH 28-SSOP Technical Specifications: Core Processor: ARM® Cortex®-M0 Core Size: 32-Bit Core Speed: 24 MHz Connectivity: I²C, IrDA, LIN, Microwire, SmartCard, SPI, SSP, UART/USART Peripherals: Brown-out Detect/Reset, LVD, POR, PWM, WDT Number of IO: 24 Program Memory Size: 16KB (16K x 8) Program Memory Type: FLASH RAM Size: 4K x 8 Supply Voltage: 1.71 V ~ 5.5 V Data Converters: A/D 8x12b Oscillator Type: Internal Operating Temperature: -40°C ~ 85°C (TA) Package / Case: 28-SSOP (0.209", 5.30mm Width) Datasheet(s): PSoC 4100 Family <http://www.cypress.com/file/138651/download> Vendor(s): Digikey: 428-3348-ND <https://www.digikey.com/product-detail/en/cypress-semiconductor-corp/CY8C4124PVI-432/428-3348-ND/4895074>; POPULATE: YES; VERIFIED: NO
U10 = openag-isolators:ADM2481BRWZ-RL7: Analog Devices - ADM2481BRWZ-RL7 - DGTL ISO RS422/RS485 16SOIC Description: RS422, RS485 Digital Isolator 2500Vrms 3 Channel 500kbps 25kV/µs CMTI 16-SOIC (0.295", 7.50mm Width) Technical Specifications: Technology: Magnetic Coupling Type: RS422, RS485 Isolated Power: No Number of Channels: 3 Inputs - Side 1/Side 2: 2/1 Channel Type: Bidirectional Voltage - Isolation: 2500Vrms Common Mode Transient Immunity (Min): 25kV/µs Data Rate: 500kbps Rise / Fall Time (Typ): 600ns, 600ns (Max) Supply Voltage: 3.3 V ~ 5 V Operating Temperature: -40°C ~ 85°C Package / Case: 16-SOIC (0.295", 7.50mm Width) Datasheet(s): ADM2481 <http://www.analog.com/media/en/technical-documentation/data-sheets/ADM2481.pdf> Vendor(s): Digikey: ADM2481BRWZ-RL7TR-ND <https://www.digikey.com/product-detail/en/analog-devices-inc/ADM2481BRWZ-RL7/ADM2481BRWZ-RL7TR-ND/2606655>
U12 = openag-regulators:LM2937IMP-3.3/NOPB: Texas Instruments - LM2937IMP-3.3/NOPB - IC REG LIN 3.3V 400MA SOT223-4 Description: Linear Voltage Regulator IC Positive Fixed 1 Output 3.3V 400mA SOT-223-4 Technical Specifications: Output Configuration: Positive Output Type: Fixed Number of Regulators: 1 Voltage - Input (Max): 26V Voltage - Output (Min/Fixed): 3.3V Voltage Dropout (Max): 1V @ 50mA Current - Output: 400mA Current - Quiescent (Iq): 2mA Current - Supply (Max): 1.25A Protection Features: Over Temperature, Reverse Polarity, Short Circuit Operating Temperature: -40°C ~ 85°C Mounting Type: Surface Mount Package / Case: TO-261-4, TO-261AA Supplier Device Package: SOT-223-4 Base Part Number: LM2937 Datasheet(s): LM2937-2.5, LM2937-3.3 Datasheet <http://www.ti.com/lit/ds/symlink/lm2937-2.5.pdf> Vendor(s): Digikey: LM2937IMP-3.3/NOPBCT-ND <https://www.digikey.com/product-detail/en/texas-instruments/LM2937IMP-3.3-NOPB/LM2937IMP-3.3-NOPBCT-ND/270742#>; POPULATE: YES; VERIFIED: NO
U14 = openag-pwm:PCA9685PW/Q900,118: NXP USA Inc. - PCA9685PW/Q900,118 - IC LED DRVR LIN DIM 25MA 28TSSOP Description: LED Driver IC 16 Output Linear PWM Dimming 25mA 28-TSSOP Technical Specifications: Type: Linear Internal Switch(s): Yes Number of Outputs: 16 Voltage - Supply (Min): 2.3V Voltage - Supply (Max): 5.5V Voltage - Output: 5.5V Current - Output / Channel: 25mA Dimming: PWM Applications: Backlight Operating Temperature: -40°C ~ 85°C (TA) Mounting Type: Surface Mount Package / Case: 28-TSSOP (0.173", 4.40mm Width) Supplier Device Package: 28-TSSOP Base Part Number: PCA9685 Datasheet(s): LED Controllers Leaflet <http://www.nxp.com/documents/leaflet/75016950.pdf> PCA9685 <https://www.nxp.com/docs/en/data-sheet/PCA9685.pdf> Vendor(s): Digikey: 568-5931-1-ND <https://www.digikey.com/product-detail/en/nxp-usa-inc/PCA9685PW-Q900118/568-5931-1-ND/2531218>
U15 = openag-buffers:PCA9615DPJ: NXP USA Inc. - PCA9615DPJ - IC REDRIVER I2C 2CH 10TSSOP Description: Buffer, ReDriver 2 Channel 400kHz 10-TSSOP Technical Specifications: Type: Buffer, ReDriver Applications: I²C Input: 2-Wire Bus Output: 2-Wire Bus Data Rate (Max): 400kHz Number of Channels: 2 Capacitance - Input: 7pF Voltage - Supply: 2.3 V ~ 5.5 V Current - Supply: 16µA Operating Temperature: -40°C ~ 85°C Package / Case: 10-TFSOP, 10-MSOP (0.118", 3.00mm Width) Supplier Device Package: 10-TSSOP Base Part Number: PCA9615 Datasheet(s): PCA9615DP <http://www.nxp.com/documents/data_sheet/PCA9615.pdf> Vendor(s): Digikey: 568-11484-1-ND <https://www.digikey.com/product-detail/en/nxp-usa-inc/PCA9615DPJ/568-11484-1-ND/4864508>
U16 = openag-regulators:MIC4680YM-TR: Microchip Technology - MIC4680YM-TR - IC REG BUCK BOOST ADJ 1.3A 8SOIC Description: Buck, Buck-Boost Switching Regulator IC Positive Adjustable 1.23V 1 Output 1.3A 8-SOIC (0.154", 3.90mm Width) Technical Specifications: Function: Step-Down, Step-Up/Step-Down Output Configuration: Positive Topology: Buck, Buck-Boost Output Type: Adjustable Number of Outputs: 1 Voltage - Input (Min): 4V Voltage - Input (Max): 34V Voltage - Output (Min/Fixed): 1.23V Voltage - Output (Max): 32.98V Current - Output: 1.3A Frequency - Switching: 200kHz Synchronous Rectifier: No Operating Temperature: -40°C ~ 125°C (TJ) Mounting Type: Surface Mount Package / Case: 8-SOIC (0.154", 3.90mm Width) Supplier Device Package: 8-SOIC Base Part Number: MIC4680 Datasheet(s): MIC4680 <http://www.microchip.com/mymicrochip/filehandler.aspx?ddocname=en579250> Vendor(s): Digikey: 576-1222-1-ND <https://www.digikey.com/scripts/DkSearch/dksus.dll?Detail&itemSeq=250950999&uq=636531791983475304>

## Board
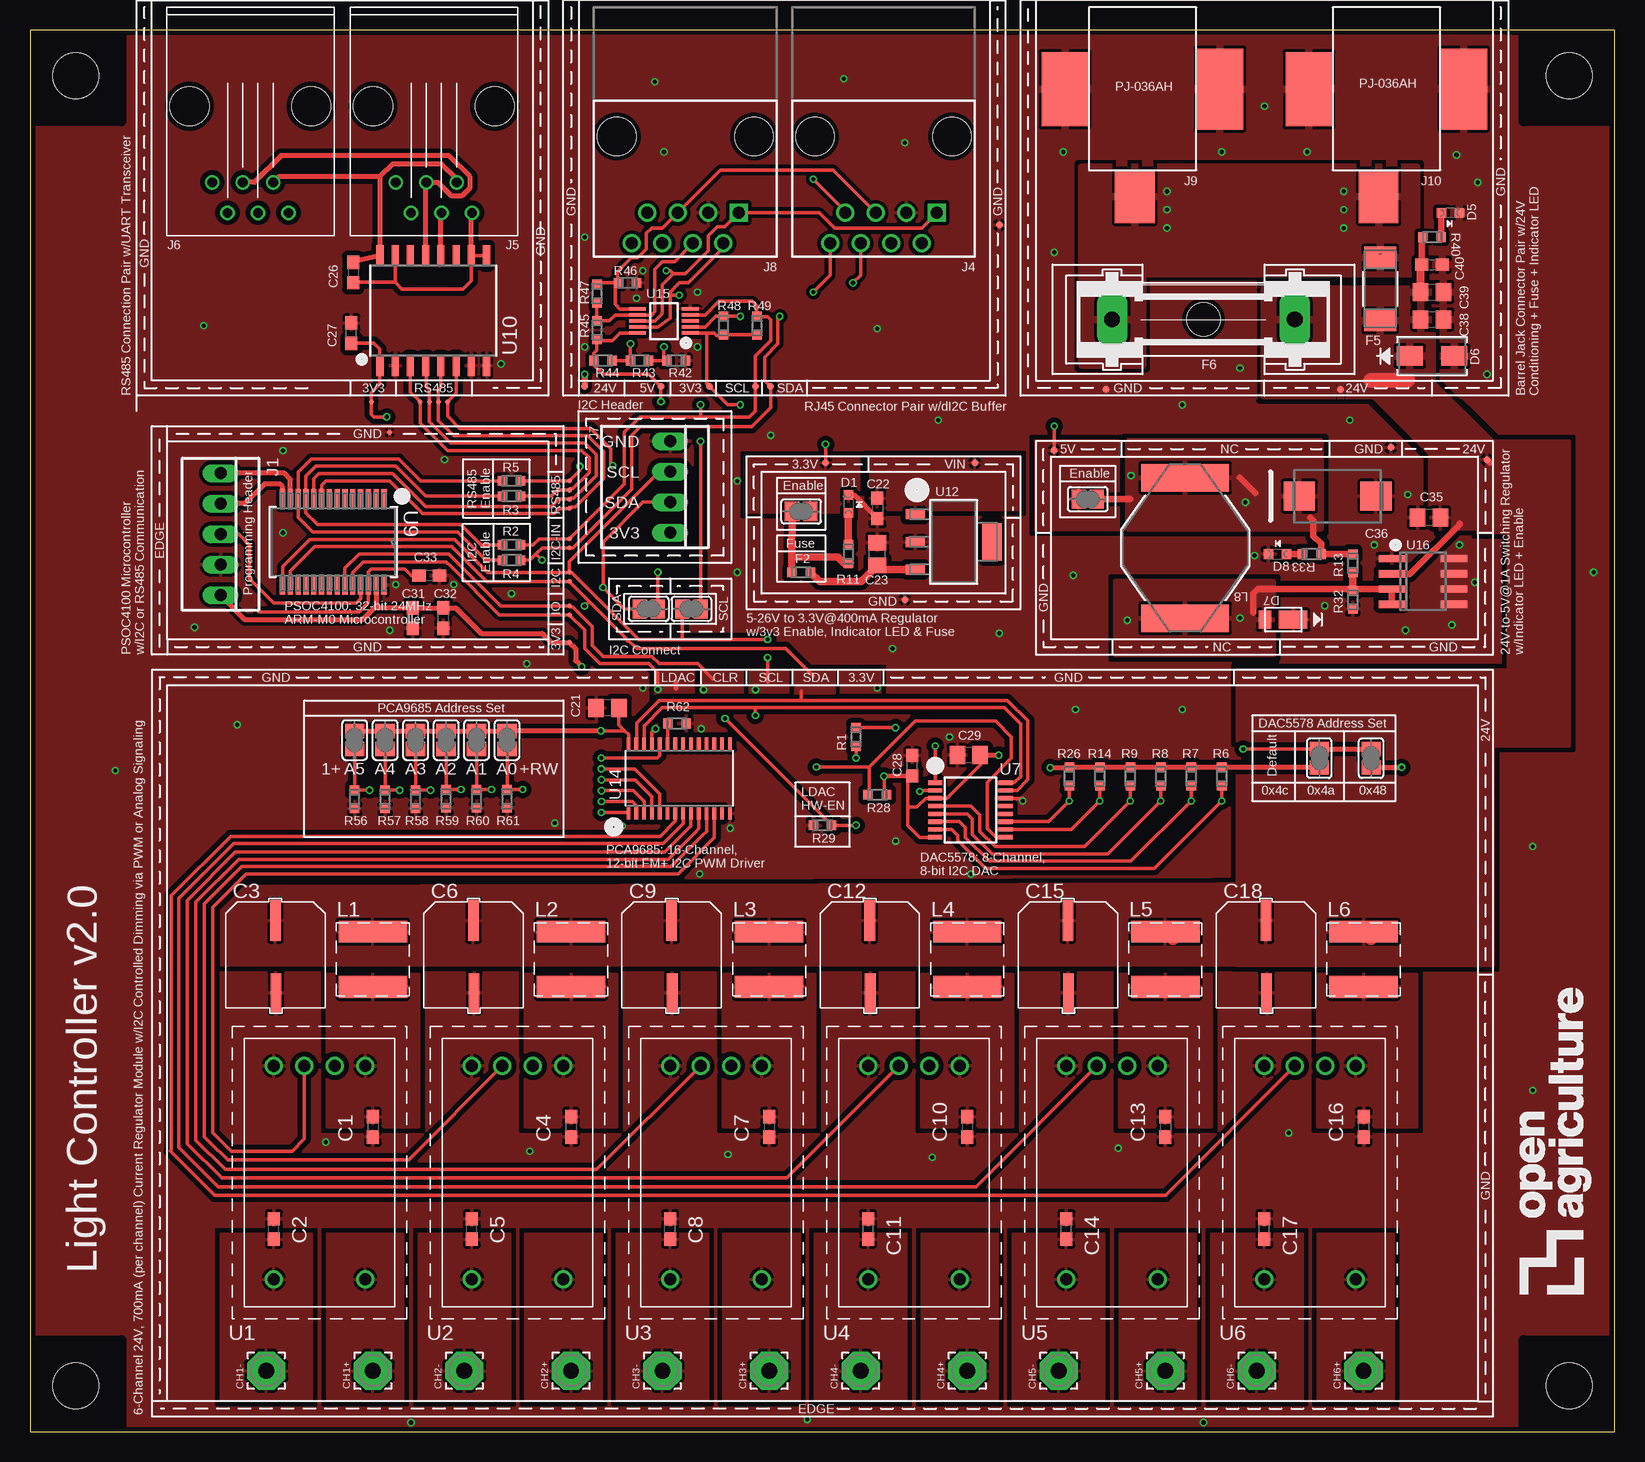
[diagram p2: board, top side]
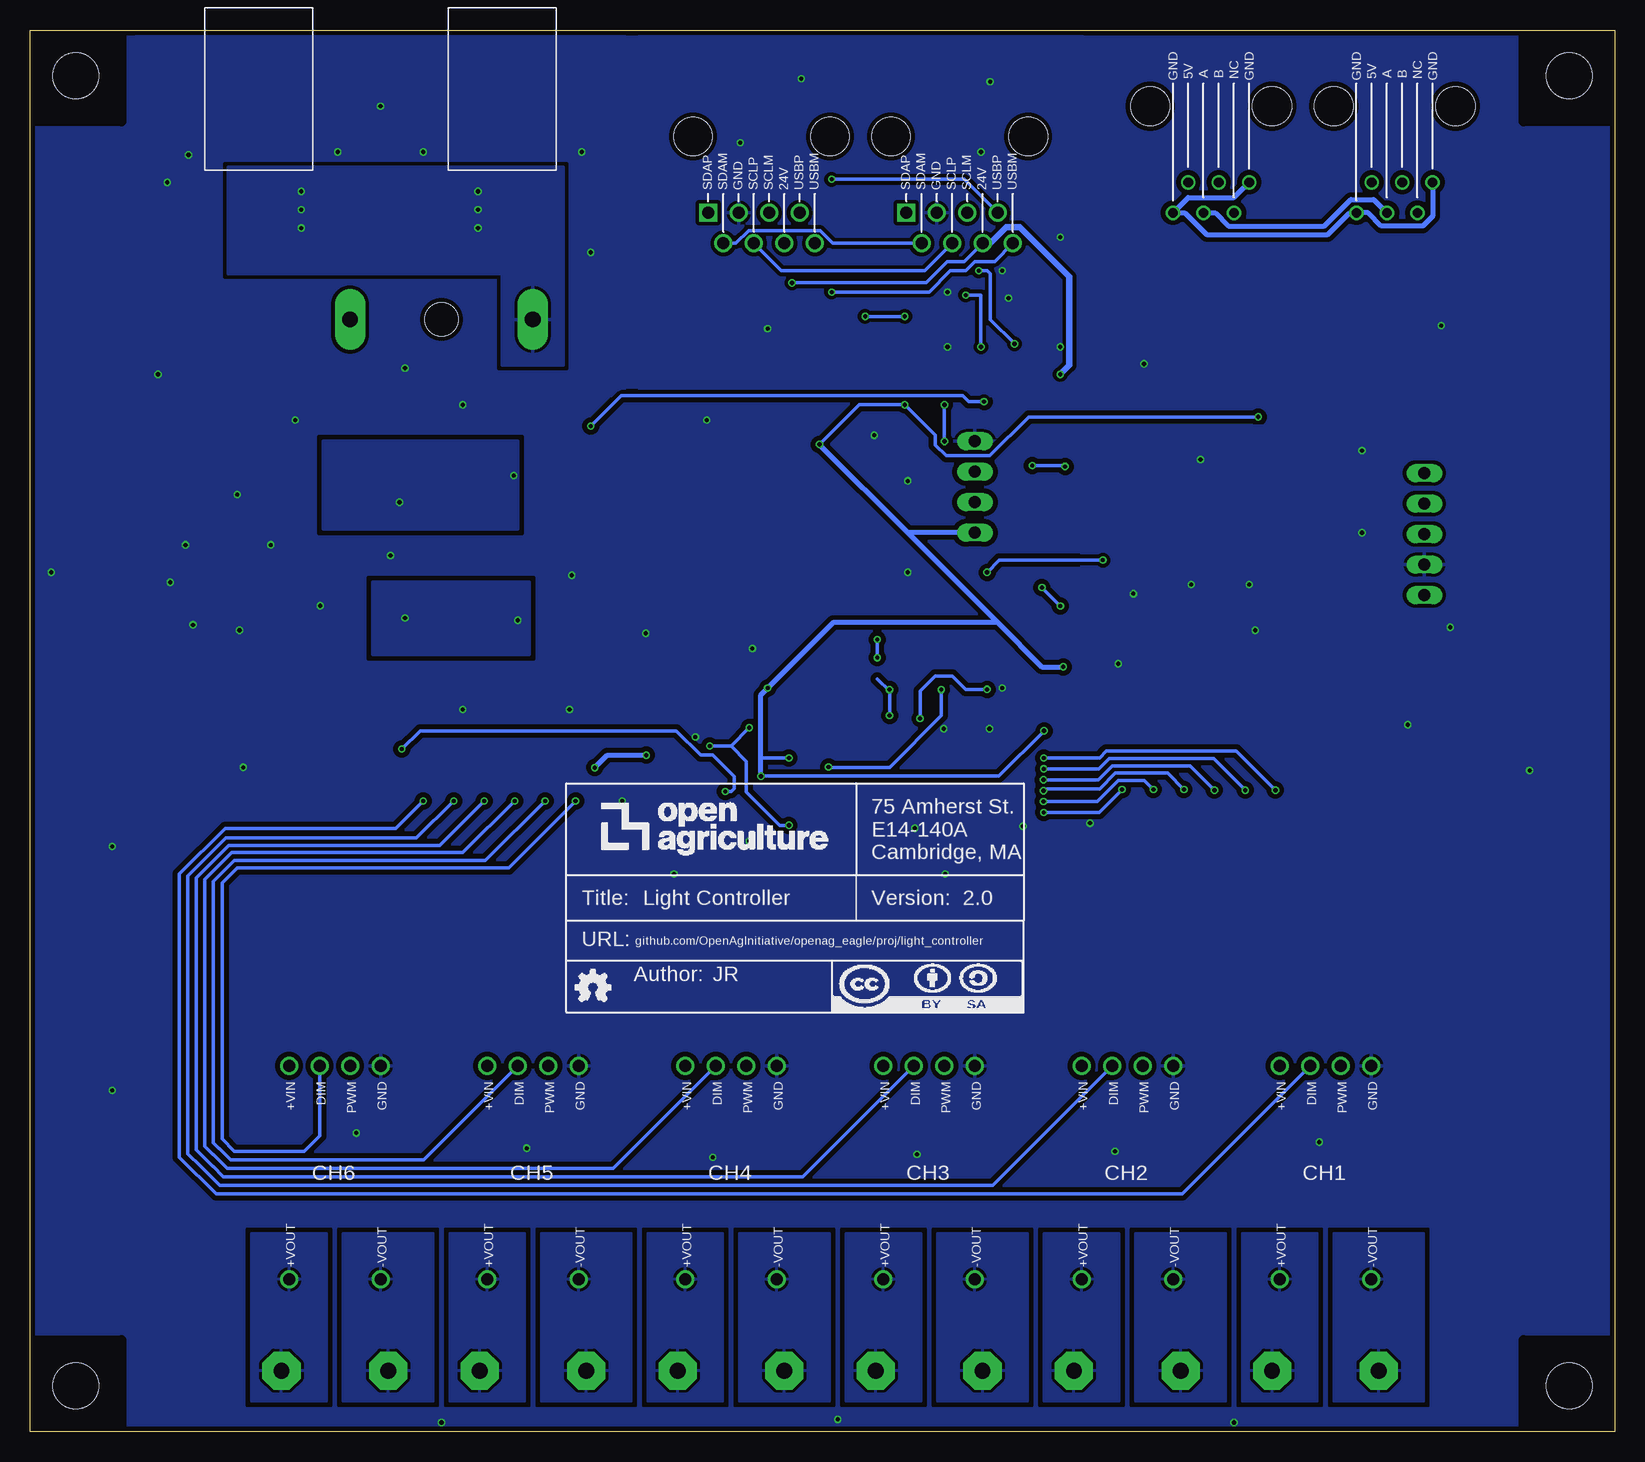
[diagram p3: board, bottom side, seen from below]

Size 132.08 x 116.84 mm. Coordinates in mm from the lower left corner, seen from the top.
Outline: 0,0 132.08,0 132.08,116.84 0,116.84 0,0
Copper layers (1*16): Top 0.035559375mm / dielectric 1.6mm / Bottom 0.035559375mm
Design rules "openag-router": minimum track width 6mil, minimum drill 10mil, track to track 12mil, track to pad 12mil, pad to pad 12mil, via to via 12mil, smd to smd 12mil, copper to edge 15mil, drill to drill 6mil, minimum pad ring 5mil, minimum via ring 5mil, stop-mask expansion 2.5mil, vias tented up to drill 20mil, thermal gap 10mil

### Footprints (pad centres in the part's own frame; a part is rotated, then mirrored left to right if it is on the bottom)
C0603 = smd 1.1 x 1: 1 -0.85,0; 2 0.85,0
EEE-1HA101UP = smd 0.889 x 3.404: + 0,-3.251 | smd 0.889 x 3.251: - -0.051,2.794
C0805 = smd 1.3 x 1.5: 1 -0.95,0; 2 0.95,0
CT7343 = smd 2.6 x 2.4: + -3.2,0; - 3.2,0
3,17/1,3 = drill 1.321 pad 3.175 octagon: 1 0,0
CHIPLED_0603 = smd 0.8 x 0.8: A 0,-0.75; C 0,0.75
SMA = smd 2.18 x 1.63: 1 -1.857,0; 2 1.857,0
POWERDI123 = smd 1.05 x 1.5: + -1.3,0 | smd 2.4 x 1.5: - 1.05,0
0603 = smd 0.756 x 0.8: 1 -0.778,0; 2 0.778,0
SS = smd 1.803 x 2.642: 1 -2.629,0; 2 2.629,0
GSH15 = drill 1.321 pad 2.54 long: 1 -7.62,0; 2 7.62,0 | hole 2.794: 0,0
22-23-2051 = drill 1 long: 1 -5.08,0; 2 -2.54,0; 3 0,0; 4 2.54,0; 5 5.08,0
OPENAG-V1-RJ45 = drill 1: 24V(6) 1.905,8.89; DSCLM(5) 0.635,6.35; DSCLP(4) -0.635,8.89; DSDAM(2) -3.175,8.89; GND(3) -1.905,6.35; USBM(8) 4.445,8.89; USBP(7) 3.175,6.35 | drill 1 square: DSDAP(1) -4.445,6.35 | hole 3.2: -5.715,0; 5.715,0
OPENAG-RS485-RJ12 = drill 0.8: 1 -8.89,-3.175; 2 -6.35,-1.905; 3 -8.89,-0.635; 4 -6.35,0.635; 5 -8.89,1.905; 6 -6.35,3.175 | hole 3.25: 0,-5.08; 0,5.08
OPENAG-I2C-HEADER = drill 1 long: 3V3 3.81,0; GND -3.81,0; SCL -1.27,0; SDA 1.27,0
PJ-036AH = smd 4.4 x 3.3: 1 2.2,-0.65 | smd 6.75 x 3.9: 2 -6.75,6.45 | smd 6.2 x 3.9: 3 -6.75,-6.45
74404064121 = smd 1.8 x 5.7: 1 -2.3,0; 2 2.3,0
UP2B = smd 2.311 x 7.29: 1 -5.855,0; 2 5.855,0
RC0603N = smd 0.756 x 0.8: 1 -0.778,0; 2 0.778,0
SOLDERJUMPER_REFLOW_NOPASTE = smd 1.168 x 1.6: 1 -0.762,0; 2 0.762,0
TP06R = smd 0.6 x 0.6: TP 0,0
TP04R = smd 0.4 x 0.4: 1 0,0
RCD-24-PINNED = drill 1: 1 0,0; 2 0,-2.54; 3 0,-5.08; 4 0,-7.62; 5 17.78,-7.62; 6 17.78,0
TSSOP16 = smd 0.35 x 1.2: 1 -2.275,-2.925; 2 -1.625,-2.925; 3 -0.975,-2.925; 4 -0.325,-2.925; 5 0.325,-2.925; 6 0.975,-2.925; 7 1.625,-2.925; 8 2.275,-2.925; 9 2.275,2.925; 10 1.625,2.925; 11 0.975,2.925; 12 0.325,2.925; 13 -0.325,2.925; 14 -0.975,2.925; 15 -1.625,2.925; 16 -2.275,2.925
SSOP-28 = smd 1.651 x 0.432: 1 -3.581,4.225; 2 -3.581,3.575; 3 -3.581,2.925; 4 -3.581,2.275; 5 -3.581,1.625; 6 -3.581,0.975; 7 -3.581,0.325; 8 -3.581,-0.325; 9 -3.581,-0.975; 10 -3.581,-1.625; 11 -3.581,-2.275; 12 -3.581,-2.925; 13 -3.581,-3.575; 14 -3.581,-4.225; 15 3.581,-4.225; 16 3.581,-3.575; 17 3.581,-2.925; 18 3.581,-2.275; 19 3.581,-1.625; 20 3.581,-0.975; 21 3.581,-0.325; 22 3.581,0.325; 23 3.581,0.975; 24 3.581,1.625; 25 3.581,2.275; 26 3.581,2.925; 27 3.581,3.575; 28 3.581,4.225
SOIC16LWB = smd 0.6 x 1.8: 1 -4.445,-4.575; 2 -3.175,-4.575; 3 -1.905,-4.575; 4 -0.635,-4.575; 5 0.635,-4.575; 6 1.905,-4.575; 7 3.175,-4.575; 8 4.445,-4.575; 9 4.445,4.575; 10 3.175,4.575; 11 1.905,4.575; 12 0.635,4.575; 13 -0.635,4.575; 14 -1.905,4.575; 15 -3.175,4.575; 16 -4.445,4.575
MP04A = smd 1.6 x 0.838: 1 -3.2,2.3; 2 -3.2,0; 3 -3.2,-2.3 | smd 1.6 x 3.099: 4 3.2,0
TSSOP28 = smd 0.305 x 0.991: 1 -4.225,-2.918; 2 -3.575,-2.918; 3 -2.925,-2.918; 4 -2.275,-2.918; 5 -1.625,-2.918; 6 -0.975,-2.918; 7 -0.325,-2.918; 8 0.325,-2.918; 9 0.975,-2.918; 10 1.625,-2.918; 11 2.275,-2.918; 12 2.925,-2.918; 13 3.575,-2.918; 14 4.225,-2.918; 15 4.225,2.918; 16 3.575,2.918; 17 2.925,2.918; 18 2.275,2.918; 19 1.625,2.918; 20 0.975,2.918; 21 0.325,2.918; 22 -0.325,2.918; 23 -0.975,2.918; 24 -1.625,2.918; 25 -2.275,2.918; 26 -2.925,2.918; 27 -3.575,2.918; 28 -4.225,2.918
SOP50P490X110-10N = smd 1.4 x 0.3: 1 -2.2,1; 2 -2.2,0.5; 3 -2.2,0; 4 -2.2,-0.5; 5 -2.2,-1; 6 2.2,-1; 7 2.2,-0.5; 8 2.2,0; 9 2.2,0.5; 10 2.2,1
SOIC8 = smd 0.6 x 2.2: 1 -1.905,-2.6; 2 -0.635,-2.6; 3 0.635,-2.6; 4 1.905,-2.6; 5 1.905,2.6; 6 0.635,2.6; 7 -0.635,2.6; 8 -1.905,2.6
OPENAG-CORNER-MOUNTING-HOLE = hole 3.81: 0,0

### Placement (x,y rotation side)
C1  28.57,25.4 270 top
C2  20.32,16.89 90 top
C3  20.45,39.37 180 top
C4  45.09,25.4 270 top
C5  36.83,16.89 90 top
C6  36.96,39.37 180 top
C7  61.59,25.4 270 top
C8  53.34,16.89 90 top
C9  53.47,39.37 180 top
C10  78.11,25.4 270 top
C11  69.85,16.89 90 top
C12  69.98,39.37 180 top
C13  94.61,25.4 270 top
C14  86.36,16.89 90 top
C15  86.49,39.37 180 top
C16  111.12,25.4 270 top
C17  102.87,16.89 90 top
C18  103,39.37 180 top
C21  48.13,60.33 180 top
C22  70.61,76.96 270 top
C23  70.61,73.15 90 top
C26  26.92,96.62 270 top
C27  26.77,91.57 90 top
C28  73.53,55.5 90 top
C29  78.23,56.39 180 top
C31  31.88,67.82 270 top
C32  34.42,67.82 270 top
C33  33.27,71.37 0 top
C35  116.59,76.2 180 top
C36  108.97,77.98 0 top
C38  116.84,92.71 0 top
C39  116.84,95 0 top
C40  116.84,97.28 0 top
CH1+  28.57,5.08 90 top
CH1-  19.68,5.08 90 top
CH2+  45.09,5.08 90 top
CH2-  36.2,5.08 90 top
CH3+  61.59,5.08 90 top
CH3-  52.7,5.08 90 top
CH4+  78.11,5.08 90 top
CH4-  69.22,5.08 90 top
CH5+  94.61,5.08 90 top
CH5-  85.72,5.08 90 top
CH6+  111.12,5.08 90 top
CH6-  102.23,5.08 90 top
D1  68.2,77.34 0 top
D5  118.36,101.6 270 top
D6  116.84,89.66 0 top
D7  104.2,67.69 0 top
D8  103.95,73.15 90 top
F2  64.26,71.63 180 top
F5  112.52,95.25 270 top
F6  97.79,92.71 0 top
FRAME1  87.38,34.92 0 bottom
J1  15.88,74.8 270 top
J4  71.12,107.95 180 top
J5  33.66,110.49 90 top
J6  18.36,110.49 90 top
J7  53.34,78.74 270 top
J8  54.61,107.95 180 top
J9  92.71,105.16 270 top
J10  113.03,105.16 270 top
L1  28.57,39.37 270 top
L2  45.09,39.37 270 top
L3  61.59,39.37 270 top
L4  78.11,39.37 270 top
L5  94.61,39.37 270 top
L6  111.12,39.37 270 top
L8  96.27,73.66 90 top
R1  68.83,57.91 90 top
R2  40.13,73.91 0 top
R3  40.13,77.98 0 top
R4  40.13,72.64 0 top
R5  40.13,79.25 0 top
R6  99.31,54.61 270 top
R7  96.77,54.61 270 top
R8  94.23,54.61 270 top
R9  91.69,54.61 270 top
R11  68.2,73.15 270 top
R13  110.24,72.39 90 top
R14  89.15,54.61 270 top
R26  86.61,54.61 270 top
R28  70.61,53.09 180 top
R29  66.04,50.55 0 top
R32  110.24,69.34 90 top
R33  106.81,73.15 0 top
R40  116.84,99.57 180 top
R42  53.85,89.28 0 top
R43  50.8,89.28 0 top
R44  47.75,89.28 0 top
R45  47.24,91.82 270 top
R46  49.78,95.76 180 top
R47  47.24,94.87 270 top
R48  57.78,92.2 270 top
R49  60.58,92.2 270 top
R56  27.05,52.71 90 top
R57  29.59,52.71 90 top
R58  32.13,52.71 90 top
R59  34.67,52.75 90 top
R60  37.21,52.75 90 top
R61  39.75,52.75 90 top
R62  53.91,59.03 0 top
SJ1  88.14,77.72 180 top
SJ3  64.26,76.71 0 top
SJ4  55.12,68.58 180 top
SJ6  51.56,68.58 180 top
SJ_A0  39.75,57.65 270 top
SJ_A1  37.21,57.65 270 top
SJ_A2  34.67,57.65 270 top
SJ_A3  32.13,57.65 270 top
SJ_A4  29.59,57.65 270 top
SJ_A5  27.05,57.65 270 top
SJ_A16  107.44,56.13 90 top
SJ_A17  111.76,56.13 90 top
TP1  60.45,87.12 270 top
TP2  61.72,87.12 270 top
TP3  89.66,86.87 180 top
TP4  109.22,86.87 180 top
TP5  56.64,87.12 270 top
TP6  80.77,100.58 270 top
TP7  52.58,87.12 270 top
TP8  44.96,68.83 0 top
TP9  29.97,83.31 0 top
TP10  46.23,87.12 270 top
TP11  44.96,79.25 0 top
TP12  85.34,81.79 0 top
TP13  113.41,82.04 0 top
TP14  121.41,81.03 0 top
TP15  72.9,69.34 0 top
TP16  78.74,80.77 0 top
TP17  66.29,80.77 0 top
TP18  44.96,70.87 0 top
TP19  44.96,65.79 0 top
TP20  44.96,78.49 0 top
TP21  44.96,77.72 0 top
TP22  44.96,76.96 0 top
TP23  44.96,68.07 0 top
TP24  44.96,71.63 0 top
TP25  44.96,73.66 0 top
TP26  44.96,74.42 0 top
TP27  28.45,85.85 0 top
TP28  34.8,85.85 270 top
TP29  32.51,85.85 270 top
TP30  33.27,85.85 270 top
TP31  34.04,85.85 270 top
U1  27.94,30.48 270 top
U2  44.45,30.48 270 top
U3  60.96,30.48 270 top
U4  77.47,30.48 270 top
U5  93.98,30.48 270 top
U6  110.49,30.48 270 top
U7  78.36,51.82 270 top
U9  25.27,74.17 270 top
U10  33.6,93.45 0 top
U12  76.96,74.17 0 top
U14  54.1,54.46 0 top
U15  52.83,92.58 180 top
U16  116.08,70.87 270 top
U$1  [OPENAG-CORNER-MOUNTING-HOLE]  3.81,3.81 0 top
U$2  [OPENAG-CORNER-MOUNTING-HOLE]  128.27,3.81 90 top
U$3  [OPENAG-CORNER-MOUNTING-HOLE]  128.27,113.03 180 top
U$4  [OPENAG-CORNER-MOUNTING-HOLE]  3.81,113.03 270 top
U$5  [OPENAG-LOGO-1000-MIL]  129.54,11.43 90 top

### Tracks (layer width: path | path; a pad name or v marks a point on that pad's centre or on a via)
24V_IN  (via drill 0.35)
  other vias: 109.47,100.33 109.47,101.85 109.47,103.38 94.74,103.38 94.74,100.33 94.74,101.85
  pour Top (isolate 0.305): 87.63,88.9 87.63,105.41 115.57,105.41 115.57,96.52 92.71,96.52 92.71,88.9
  pour Bottom (isolate 0.305): 115.57,105.41 87.63,105.41 87.63,88.9 92.71,88.9 92.71,96.52 115.57,96.52
485_5V
  Top 0.305: 29.09,99 29.16,99.06
  Top 0.406: J5.2 35.56,104.39 34.29,105.66 30.23,105.66 29.16,104.6 | 29.16,104.6 29.16,99.06 U10.16 26.97,97.51 C26.1 | 29.16,104.6 20.73,104.6 J6.2
485_A
  Top 0.305: 34.16,97.2 U10.12
  Top 0.406: U10.12 34.24,101.55 J5.3
  Bottom 0.406: J5.3 33.32,101.6 32.21,100.49 24.21,100.49 22,102.71 20.11,102.71 J6.3
485_B
  Top 0.305: 32.89,97.46 U10.13
  Top 0.406: U10.13 32.97,104.09 J5.4 33.99,104.14 35.1,103.03 36.02,103.03 36.67,103.68 36.67,104.6 34.89,106.38 20.94,106.38 18.7,104.14 J6.4
485_GND
  Top 0.305: U10.9 U10.10 36.78,95.96 36.07,95.25 30.99,95.25 30.43,95.81 | 30.43,95.81 U10.15 30.43,95.96 | 30.43,95.81 26.96,95.81 C26.2
  Top 0.406: U10.10 36.78,101.55 J5.1
  Bottom 0.406: J5.6 31.75,102.87 35.56,102.87 J5.1 35.86,101.6 34.04,99.78 23.92,99.78 22.1,101.6 J6.1 20.57,101.6 19.46,100.49 16,100.49 15.19,101.3 J6.6
!LDAC!  (via drill 0.35)
  Top 0.305: v75.44,57.15 75.43,56.38 U7.1 | v68.83,50.55 R29.2 66.2,51.16 66.2,51.18 57.94,59.44 v57.91,59.44 | R1.2 v72.12,58.69 v72.13,58.68 | v52.32,61.87 52.32,63.25 51.56,64.01 47.5,64.01 46.23,65.28 46.23,66.8 TP23.1 39.12,68.07 35.13,72.06 34.7,72.49 27.77,72.49 26.9,71.62 U9.24
  Top 0.406: 53.85,61.98 53.85,62.48
  Bottom 0.305: v68.83,50.55 69.6,50.55 72.39,53.34 72.39,55.88 73.66,57.15 | v57.91,59.44 57.91,61.72 56.64,62.99 55.22,62.99 54.1,61.87 v52.32,61.87 | v72.13,58.68 73.66,57.15 | 73.66,57.15 v75.44,57.15
  pour Top (isolate 0.406): 55.37,61.47 55.37,63.5 52.07,63.5 52.07,61.47
+3V3  (via drill 0.35)
  Top 0.305: U14.28 49.88,58.12 49.58,58.42 | SJ_A0.1 | 49.58,58.42 v47.57,58.42 | C21.1 49.08,58.92 49.58,58.42 | C29.1 79.18,55.56 76.41,52.79 U7.3 74.64,52.79 73.91,52.07 73.15,52.07 | U7.8 74.16,49.54 73.15,50.55 73.15,52.07 | v71.17,54.63 71.17,53.3 R28.1 | U15.1 56.39,91.58 | 56.39,91.58 57.01,91.58 57.24,91.35 57.71,91.35 R48.2 R49.2 | 56.39,91.58 56.39,87.38 TP5.TP 58.17,85.6 v59.18,85.6 | v66.29,82.3 TP17.TP | C27.1 28.66,90.72 29.16,90.22 U10.1 29.16,87.33 28.45,86.61 TP27.1 28.45,84.84 28.7,84.58 v29.72,84.58 | R1.1 v68.83,56.15 | 73.15,52.07 73.15,54.65
  Top 0.356: C28.1 73.15,54.65 71.18,54.65 v71.17,54.63
  Top 0.406: SJ_A0.1 SJ_A1.1 SJ_A2.1 SJ_A3.1 SJ_A4.1 SJ_A5.1 27.02,58.45 | C29.1 v80.72,56.39 | v85.01,55.35 86.57,55.35 R26.1 R14.1 R9.1 R8.1 R7.1 R6.1 107.44,55.39 SJ_A16.1 | SJ_A0.1 v47.57,58.41 v47.57,58.42 | 39.88,58.54 SJ_A0.1 | 28.86,68.93 29.12,68.67 C31.1 C32.1 35.47,68.67 37.59,66.55 42.67,66.55 43.43,65.79 TP19.1 45.47,65.28 45.47,64.26 v45.97,63.75 | 28.86,68.93 28.86,68.82 27.71,67.67 17.93,67.67 J1.5 | U9.27 28.86,70.58 28.86,68.93
  Bottom 0.305: v47.57,58.42 51.36,54.63 v71.17,54.63 | v66.29,82.3 62.99,85.6 v59.18,85.6 56.64,83.06 56.64,82.24 55.75,81.34 52.09,81.34 48.85,84.58 v29.72,84.58 | v68.83,56.15 71.15,56.15 71.17,56.13
  Bottom 0.406: v80.72,56.39 83.97,56.39 v85.01,55.35 | v71.17,54.63 71.17,56.13 71.17,61.42 v70.61,61.98 65.15,67.44 51.44,67.44 | v45.97,63.75 47.75,63.75 51.44,67.44 | v66.29,82.3 58.93,74.93 | 58.93,74.93 51.44,67.44 | J7.3V3 58.93,74.93
  pour Top (isolate 0.406): 67.56,63.5 70.87,63.5 70.87,61.21 67.56,61.21
  pour Top: 69.09,81.28 69.09,76.58 59.69,76.58 59.69,81.28
+5V  (via drill 0.35)
  Top 0.305: U15.10 49.16,91.58 48.51,90.93 47.28,90.93 R45.2 47.24,90.17 46.97,89.9 R44.1 46.97,88.92 47.75,88.14 51.56,88.14 TP7.TP v52.58,85.85 | v85.34,83.82 TP12.TP
  Bottom 0.305: v52.58,85.85 53.85,85.85 54.36,86.36 82.8,86.36 v85.34,83.82
  pour Top (isolate 0.305): 83.82,75.18 90.68,75.18 90.68,82.55 83.82,82.55
+24V
  Top 0.559: C40.1 115.99,99.57 R40.2 | U16.2 115,71.5 119.13,75.63 119.13,75.69 | 121.67,80.77 TP14.TP
  Top 0.66: C39.1 115.89,97.28 C40.1
  Top 1.016: 95.25,41.03 L5.1 | 111.76,41.03 L6.1
  Top 1.27: 114.81,87.63 111.76,87.63
  pour Top (isolate 0.406): 115.57,38.86 115.57,45.72 15.88,45.47 15.88,38.86
  pour Top (isolate 0.406): 100.58,63.5 100.58,38.86 121.92,38.86 121.92,63.5
  pour Top (isolate 0.305): 102.87,86.36 102.87,95.25 116.84,95.25 116.84,86.36
  pour Top: 121.92,82.55 116.65,82.55 116.65,75.25 121.92,75.25
  pour Top (isolate 0.305): 116.84,81.28 121.92,81.28 121.92,82.55
  pour Top (isolate 0.305): 111.76,86.36 116.84,81.28 121.92,81.28 121.92,82.55 116.84,87.63 111.76,87.63
  pour Top (isolate 0.305): 120.65,82.55 120.65,74.93 123.19,74.93 123.19,63.5 120.65,63.5 120.65,57.15 128.27,57.15 128.27,82.55
A0  (via drill 0.35)
  Top 0.305: SJ_A0.2 R61.2 v41.06,53.52 v41.07,53.52 | U14.1 49.8,51.61 v47.6,51.61
  Bottom 0.305: v47.6,51.61 42.98,51.61 v41.07,53.52
A1  (via drill 0.35)
  Top 0.305: SJ_A1.2 R60.2 38.45,53.52 v38.46,53.52 | U14.2 50.53,52.18 50.19,52.52 v47.62,52.52
  Bottom 0.305: v47.62,52.52 43.14,52.52 41.39,54.28 39.22,54.28 v38.46,53.52
A2  (via drill 0.35)
  Top 0.305: SJ_A2.2 R59.2 35.91,53.52 v35.92,53.52 | U14.3 51.18,52.53 50.28,53.43 v47.62,53.43
  Bottom 0.305: v47.62,53.43 47.48,53.58 42.95,53.58 41.64,54.89 37.28,54.89 v35.92,53.52
A3  (via drill 0.35)
  Top 0.305: SJ_A3.2 R58.2 33.35,53.49 v33.38,53.47 | U14.4 51.83,52.95 50.44,54.34 v47.62,54.34
  Bottom 0.305: v47.62,54.34 43.05,54.34 41.89,55.5 35.41,55.5 v33.38,53.47
A4  (via drill 0.35)
  Top 0.305: SJ_A4.2 R57.2 | R57.2 29.69,53.39 | R57.2 30.79,53.49 v30.81,53.47 | U14.5 52.48,53.16 50.39,55.25 v47.6,55.25
  Bottom 0.305: v47.6,55.25 43,55.25 42.14,56.11 33.45,56.11 v30.81,53.47
A5  (via drill 0.35)
  Top 0.254: 26.88,53.49 R56.2
  Top 0.305: 52.48,56.69 U14.24 52.48,56.36 52.27,56.16 v47.6,56.16 | SJ_A5.2 27.05,53.66 26.88,53.49 | 27.15,53.39 R56.2 28.27,53.49 v28.3,53.47
  Bottom 0.305: v47.6,56.16 42.95,56.16 42.4,56.72 31.54,56.72 v28.3,53.47
ADDR0  (via drill 0.35)
  Top 0.305: v101.09,56.9 SJ_A16.2 | U7.2 74.21,53.44 v74.14,53.37
  Top 0.406: SJ_A16.2 SJ_A17.2
  Bottom 0.305: v74.14,53.37 73.63,53.37 73.41,53.59 73.41,54.61 75.19,56.39 76.18,56.39 78.21,58.42 99.57,58.42 v101.09,56.9
CH1+
  pour Bottom (isolate 0.406): 24.77,2.54 24.77,16.51 31.11,16.51 31.11,2.54
  pour Top (isolate 0.406): 24.77,2.54 24.77,16.51 31.11,16.51 31.11,2.54
CH1-
  pour Top (isolate 0.406): 15.88,2.54 15.88,16.51 23.5,16.51 23.5,2.54
  pour Bottom (isolate 0.406): 15.88,2.54 15.88,16.51 23.5,16.51 23.5,2.54
CH2+
  pour Bottom (isolate 0.406): 41.27,2.54 41.27,16.51 47.62,16.51 47.62,2.54
  pour Top (isolate 0.406): 41.27,2.54 41.27,16.51 47.62,16.51 47.62,2.54
CH2-
  pour Top (isolate 0.406): 32.38,2.54 32.38,16.51 40.01,16.51 40.01,2.54
  pour Bottom (isolate 0.406): 32.38,2.54 32.38,16.51 40.01,16.51 40.01,2.54
CH3+
  pour Bottom (isolate 0.406): 57.78,2.54 57.78,16.51 64.14,16.51 64.14,2.54
  pour Top (isolate 0.406): 57.78,2.54 57.78,16.51 64.14,16.51 64.14,2.54
CH3-
  pour Top (isolate 0.406): 48.9,2.54 48.9,16.51 56.52,16.51 56.52,2.54
  pour Bottom (isolate 0.406): 48.9,2.54 48.9,16.51 56.52,16.51 56.52,2.54
CH4+
  pour Bottom (isolate 0.406): 74.3,2.54 74.3,16.51 80.64,16.51 80.64,2.54
  pour Top (isolate 0.406): 74.3,2.54 74.3,16.51 80.64,16.51 80.64,2.54
CH4-
  pour Top (isolate 0.406): 65.41,2.54 65.41,16.51 73.03,16.51 73.03,2.54
  pour Bottom (isolate 0.406): 65.41,2.54 65.41,16.51 73.03,16.51 73.03,2.54
CH5+
  pour Bottom (isolate 0.406): 90.81,2.54 90.81,16.51 97.16,16.51 97.16,2.54
  pour Top (isolate 0.406): 90.81,2.54 90.81,16.51 97.16,16.51 97.16,2.54
CH5-
  pour Top (isolate 0.406): 81.92,2.54 81.92,16.51 89.53,16.51 89.53,2.54
  pour Bottom (isolate 0.406): 81.92,2.54 81.92,16.51 89.53,16.51 89.53,2.54
CH6+
  pour Bottom (isolate 0.406): 107.31,2.54 107.31,16.51 113.67,16.51 113.67,2.54
  pour Top (isolate 0.406): 107.31,2.54 107.31,16.51 113.67,16.51 113.67,2.54
CH6-
  pour Top (isolate 0.406): 98.42,2.54 98.42,16.51 106.05,16.51 106.05,2.54
  pour Bottom (isolate 0.406): 98.42,2.54 98.42,16.51 106.05,16.51 106.05,2.54
DAC_!CLR!  (via drill 0.35)
  Top 0.305: 69.92,55.4 73.76,59.23 80.47,59.23 81.79,57.91 81.79,56.13 79.76,54.1 79.76,50.3 80.51,49.54 U7.9 | 69.92,55.4 v65.53,55.4 | 69.92,55.4 69.92,53.17 R28.2 | U9.23 26.25,71.97 27.43,73.15 34.91,73.15 35.74,72.32 35.74,72.31 39.22,68.83 TP8.1 45.06,68.73 45.23,68.73 46.84,67.12 46.84,65.53 47.75,64.62 51.81,64.62 52.42,64.01 55.63,64.01 56.9,62.74
  Bottom 0.305: v56.13,61.85 56.13,59.69 60.45,55.37 65.51,55.37 v65.53,55.4
  pour Top (isolate 0.406): 59.44,63.5 55.88,63.5 55.88,61.47 59.44,61.47
DIM1  (via drill 0.35)
  Top 0.305: R6.2 v99.31,52.58 93.67,46.94 79.67,46.94 77.32,49.29 77.32,49.68 76.81,50.19 U7.7
  Top 0.356: 75.39,50.15 U7.7
  Bottom 0.305: U1.2 36.07,19.81 116.58,19.81 119.63,22.87 119.63,46.48 115.82,50.29 101.6,50.29 v99.31,52.58
DIM2  (via drill 0.35)
  Top 0.305: R7.2 v96.77,52.58 91.75,47.55 79.92,47.55 77.93,49.54 77.93,50.34 77.43,50.84 U7.6
  Bottom 0.305: U2.2 51.87,20.52 116.27,20.52 117.85,22.1 117.86,22.1 118.92,23.16 118.92,46.32 115.77,49.48 99.87,49.48 v96.77,52.58
DIM3  (via drill 0.35)
  Top 0.305: R8.2 v94.23,52.58 89.81,48.16 80.17,48.16 78.54,49.79 78.54,51.05 78.1,51.49 U7.5 75.42,51.47
  Bottom 0.305: U3.2 67.67,21.23 115.96,21.23 116.82,22.1 116.84,22.1 118.21,23.47 118.21,46.17 115.52,48.87 97.94,48.87 v94.23,52.58
DIM4  (via drill 0.35)
  Top 0.305: R9.2 v91.69,52.58 87.88,48.77 80.42,48.77 79.15,50.05 79.15,51.41 78.42,52.14 U7.4
  Bottom 0.305: U4.2 83.46,21.95 115.66,21.95 116.83,23.11 116.84,23.11 117.5,23.77 117.5,46.02 115.26,48.26 96.01,48.26 v91.69,52.58
DIM5  (via drill 0.35)
  Top 0.305: R14.2 v89.15,52.58 86.77,50.19 U7.10
  Bottom 0.305: U5.2 99.26,22.66 115.36,22.66 116.32,23.62 116.33,23.62 116.79,24.08 116.79,45.87 115.06,47.6 94.13,47.6 v89.15,52.58
DIM6  (via drill 0.35)
  Top 0.305: R26.2 v86.61,52.58 84.88,50.84 U7.11
  Bottom 0.305: U6.2 107.95,24.64 109.22,23.37 115.06,23.37 116.08,24.38 116.08,45.72 114.81,46.99 92.2,46.99 v86.61,52.58
DSCLM
  Top 0.305: R47.1 47.28,95.76 48.77,95.76 | 48.77,95.76 R46.2 48.93,96.69 50.1,97.85 50.66,97.85 51.37,98.56 51.37,99.89 51.82,100.33 52.7,100.33 J8.DSCLM(5) 57.53,105.16 66.93,105.16 J4.DSCLM(5) | U15.6 49.16,93.58 48.77,93.98 48.77,95.76
DSCLP
  Top 0.305: R47.2 R45.1 48.28,92.6 48.77,93.08 U15.7 51.81,93.08 52.07,93.34 52.07,96.9 52.7,97.54 53.72,97.54 J8.DSCLP(4)
  Bottom 0.305: J4.DSCLP(4) 69.47,96.77 57.53,96.77 J8.DSCLP(4)
DSDAM  (via drill 0.35)
  Top 0.305: 53.34,94.74 53.34,92.84 52.32,92.08 U15.9 | R43.2 R42.1 arc-90 52.83,89.45 v52.83,90.42 52.83,90.55 | v54.1,94.74 53.34,94.74 | 53.34,94.74 53.34,95 54.1,95.76 54.86,95.76 57.78,98.68 J8.DSDAM(2)
  Bottom 0.305: v52.83,90.42 52.83,94.74 v54.1,94.74 | J4.DSDAM(2) 73.25,99.06 72.19,100.11 66.24,100.11 65.18,99.06 J8.DSDAM(2)
DSDAP  (via drill 0.35)
  Top 0.305: R44.2 R43.1 50.02,90.66 v50.04,90.68 | 53.59,96.52 52.7,95.63 52.7,93.34 52.65,93.17 52.07,92.58 U15.8 | 53.59,96.52 54.61,96.52 56.52,98.42 56.52,99.69 57.28,100.46 57.91,100.46 J8.DSDAP(1) 65.79,101.6 67.06,100.33 74.3,100.33 J4.DSDAP(1) | 53.59,96.52 53.34,96.78 v53.02,96.78
  Bottom 0.305: v50.04,90.68 52.07,92.71 52.07,96.52 52.33,96.78 v53.02,96.78
GND  (via drill 0.35)
  Top 0.254: 34.64,51.76 R59.1
  Top 0.305: U7.14 82.74,52.79 82.78,52.76 | U14.25 51.83,58.3 v52.12,58.6
  Top 0.406: SJ_A17.1 v114.3,55.37 | D1.C 68.63,78.09 C22.2
  other vias: 39.24,89 58.34,50.29 76.63,57.91 72.14,49.23 55.93,58.6 82.73,52.58 118.87,106.43 106.43,106.68 99.31,106.68 86.11,106.68 102.87,110.49 85.34,98.3 100.84,88.65 121.41,88.14 120.65,104.14 55.63,95 55.63,90.42 50.55,94.49 51.05,96.77 46.23,90.42 46.23,99.57 52.07,112.52 52.83,106.68 67.82,112.78 72.9,107.44 112.01,73.91 119.13,73.91 102.04,73.03 107.89,68.83 118.49,67.25 120.4,70.8 114.62,66.8 86.93,71.37 114.81,78.11 21.08,74.93 35.31,70.61 30.48,70.61 29.97,66.8 40.13,69.85 13.72,67.06 34.54,81.03 21.08,81.79 24.64,24.13 41.66,23.37 58.17,23.11 75.18,22.86 90.68,23.62 104.9,24.89 17.27,58.93 7.11,55.12 71.88,65.28 80.77,66.55 87.12,60.2 96.01,60.2 61.72,83.06 75.69,84.33 70.61,91.95 109.98,84.33 96.01,85.6 125.22,48.77 125.22,28.45 31.75,0.76 41.4,64.01 51.05,61.98 43.74,50.72 49.33,50.47 55.8,46.48 78.41,46.48 64.77,1.02 97.79,0.76 130.3,71.63 14.48,92.2 58.93,71.63 58.93,79.25
  pour Top (isolate 0.406, rank 3): 0,0 132.08,0 132.08,116.84 0,116.84
  pour Bottom (isolate 0.406, rank 3): 0,0 132.08,0 132.08,116.84 0,116.84
  pour Top (isolate 0.305, rank 2): 82.55,86.36 82.55,120.65 123.19,120.65 123.19,86.36
  pour Bottom (isolate 0.305, rank 3): 82.55,86.36 123.19,86.36 123.19,120.65 82.55,120.65
  pour Top (isolate 0.305): 44.45,120.65 44.45,86.36 81.28,86.36 81.28,120.65
  pour Bottom (isolate 0.305): 44.45,86.36 81.28,86.36 81.28,120.65 44.45,120.65
  pour Top (isolate 0.406, rank 2): 83.82,64.77 121.92,64.77 121.92,82.55 83.82,82.55
  pour Bottom (isolate 0.406, rank 2): 83.82,64.77 121.92,64.77 121.92,82.55 83.82,82.55
  pour Top (isolate 0.305, no thermals): 117.47,73.34 120.21,73.34 120.21,68.26 117.47,68.26
  pour Top (isolate 0.406, rank 3): 59.69,81.28 59.69,68.58 82.55,68.58 82.55,81.28
  pour Top (isolate 0.305, rank 2): 10.16,64.77 44.45,64.77 44.45,83.82 10.16,83.82
  pour Bottom (isolate 0.305): 44.45,83.82 10.16,83.82 10.16,64.77 44.45,64.77
LIN_REG_VIN
  pour Top: 69.98,81.28 69.98,76.83 82.55,76.83 82.55,81.28
N$1
  pour Top (isolate 0.406): 24.77,25.4 24.77,38.1 32.38,38.1 32.38,25.4
N$2
  pour Top (isolate 0.406): 41.27,25.4 41.27,38.1 48.9,38.1 48.9,25.4
N$4
  pour Top (isolate 0.406): 57.78,25.4 57.78,38.1 65.41,38.1 65.41,25.4
N$5
  pour Top (isolate 0.406): 74.3,25.4 74.3,38.1 81.92,38.1 81.92,25.4
N$6
  pour Top (isolate 0.406): 90.81,25.4 90.81,38.1 98.42,38.1 98.42,25.4
N$7
  pour Top (isolate 0.406): 107.31,25.4 107.31,38.1 115.57,38.1 115.57,25.4
N$10
  Top 0.61: D1.A R11.1
N$11  (via drill 0.35)
  Top 0.559: 110.35,70.23 U16.3 U16.4 | 110.35,70.23 R32.2 | 101.92,68.28 101.92,69.85 102.3,70.23 110.35,70.23
  Top 0.61: R13.1 R32.2
  other vias: 100.84,67.82 91.44,67.63
  pour Top (isolate 0.305): 90.42,70.87 90.42,64.77 103.63,64.77 103.63,70.87
  pour Bottom (isolate 0.305): 90.49,64.77 90.49,70.8 103.5,70.8 103.5,64.77
N$12
  Top 0.61: 70.79,71.87 C23.1 | C23.1 70.95,71.87 U12.3 | F2.1 65.8,70.87 69.28,70.87 C23.1
N$22
  Top 0.559: R33.1 D8.A
N$23
  Top 0.305: U9.26 | U9.26 28.2,71.63 28.45,71.88 31.24,71.88 31.75,71.37 C33.1 | U9.26 28.2,69.09 27.43,68.33 19.05,68.33
N$24  (via drill 0.35)
  Top 0.559: 100.83,79.52 102.11,78.23 | R13.2 107.6,73.17 R33.2 107.58,74.03 106.95,74.66 106.95,75.93 106.68,76.2 | SJ1.1 91.69,77.72
  Top 0.61: SJ1.1 88.92,77.74
  other vias: 101.28,77.47 91.76,79.69
  pour Top: 91.44,82.55 91.44,75.25 107.63,75.25 107.63,82.55
  pour Bottom (isolate 0.305): 91.44,82.55 91.44,75.25 107.63,75.25 107.63,82.55
N$26
  Top 0.559: R40.1 D5.A
N/C  (via drill 0.35)
  Top 0.305: J4.24V(6) 69.22,96.39 v68.58,95.76
  Top 0.559: v46.23,88.14 TP10.TP
  Bottom 0.305: 52.05,99.06 J8.24V(6) 54.23,97.54 55.63,97.54 57.4,95.76 v68.58,95.76
  Bottom 0.559: 52.05,99.06 50.72,100.39 49.59,100.39 45.47,96.27 45.47,88.9 v46.23,88.14
OE
  Top 0.305: U14.23 R62.1
PWM1
  Top 0.305: U1.3 22.86,24.38 21.84,23.37 16.76,23.37 15.24,24.89 15.24,43.69 18.03,46.48 54,46.48 57.03,49.51 U14.12
PWM2
  Top 0.305: U2.3 31.55,22.66 16.47,22.66 15,24.13 14.99,24.13 14.53,24.59 14.53,43.99 17.63,47.09 53.44,47.09 56.03,49.68 56.38,50.03 U14.11
PWM3
  Top 0.305: U3.3 47.24,21.84 16.27,21.84 13.82,24.29 13.82,44.14 17.38,47.7 53.17,47.7 55.43,49.96 | U14.10 55.73,50.26 55.43,49.96 | 55.45,49.96 55.43,49.96
PWM4
  Top 0.305: U4.3 63.04,21.13 15.97,21.13 13.11,24 13.11,44.3 17.12,48.31 52.92,48.31 55.08,50.47 U14.9
PWM5
  Top 0.305: U5.3 78.84,20.42 15.68,20.42 12.39,23.7 12.39,44.45 16.97,49.02 52.77,49.02 54.43,50.68 U14.8
PWM6
  Top 0.305: U6.3 94.64,19.71 15.38,19.71 11.68,23.41 11.79,23.51 11.79,44.7 16.72,49.63 52.51,49.63 53.78,50.9 U14.7
REG_3V3_400MA
  Top 0.61: SJ3.1 63.48,72.9 | 63.48,72.9 F2.2 | R11.2 67.83,72.37 67.31,72.9 63.48,72.9
SCB1_RX[0]_SCL[0]
  Top 0.305: R3.1 32.97,77.98 30.48,80.47 23.82,80.47 23,79.64 U9.11 23,76.57 23.98,75.59 35.91,75.59 37.59,73.91 R2.1
SCB1_TX[0]_SDA[0]
  Top 0.305: R5.1 32.56,79.25 30.73,81.08 23.42,81.08 22.35,80.01 U9.12 22.35,76.2 23.57,74.98 35.66,74.98 38,72.64 R4.1
SCL  (via drill 0.35)
  Top 0.305: U7.16 82.03,54.09 82.55,54.61 82.55,59 81.2,60.35 60.45,60.35 | U14.26 51.18,58.82 52.7,60.35 60.45,60.35 | 60.45,60.35 v60.45,59.69 | U9.15 21.05,72.1 23.32,74.37 35.41,74.37 38.15,71.63 TP24.1 | v61.47,64.52 61.47,62.48 | 54.36,66.04 50.72,66.04 45.12,71.63 TP24.1 | 54.36,66.04 v61.47,66.04 | SJ4.2 54.36,66.04 | J7.SCL 52.42,80.01 44.96,72.54 TP24.1
  Bottom 0.305: v60.45,59.69 60.45,61.72 | 60.45,61.72 v60.45,61.85 | 61.47,62.74 60.45,61.72 | v61.47,66.04 v61.47,64.52
  pour Top (isolate 0.406): 59.94,63.5 59.94,61.47 63.25,61.47 63.25,63.5
SCL_IN  (via drill 0.35)
  Top 0.305: R2.2 41.91,73.91 42.42,74.42 TP26.1 49.53,78.99 49.53,83.31 50.8,84.58 55.88,84.58 | U15.4 56.25,93.08 57.4,94.23 60.2,94.23 60.58,93.85 R49.1 60.59,92.96 61.47,92.96 61.72,92.71 61.72,90.93 60.45,89.66 TP1.TP 60.45,85.09 59.94,84.58 55.88,84.58 | SJ4.1 v55.88,82.55 | v55.88,85.6 55.88,84.58
  Bottom 0.305: v55.88,82.55 v55.88,85.6
SDA  (via drill 0.35)
  Top 0.305: U7.15 81.3,53.46 82.26,53.46 83.16,54.36 83.16,59.26 81.46,60.96 64.26,60.96 | U14.27 50.57,57.42 50.57,59.08 52.45,60.96 64.26,60.96 | 64.26,60.96 64.26,61.72 | U9.16 21.7,71.74 23.72,73.76 35.16,73.76 38.05,70.87 TP18.1 46.61,69.22 | 65.28,62.99 62.99,65.28 50.55,65.28 49.78,66.04 | 46.61,69.22 49.78,66.04 | 49.78,65.89 49.78,66.04 | SJ6.2 49.53,68.58 v47.75,70.36 47.75,74.17 51.05,77.47 J7.SDA | v46.21,68.82 46.61,69.22
  Bottom 0.305: v47.75,70.36 v46.21,68.82
  pour Top (isolate 0.406): 63.75,63.5 67.06,63.5 67.06,61.47 63.75,61.47
SDA_IN  (via drill 0.35)
  Top 0.305: U15.2 56.27,92.08 57.17,92.98 R48.1 59.17,92.98 v59.18,92.96 | v62.48,92.96 62.33,92.81 62.33,90.68 61.21,89.56 61.21,87.63 TP2.TP 61.72,85.34 60.15,83.77 50.85,83.77 50.14,83.06 50.14,78.59 45.21,73.66 TP25.1 42.67,73.66 42.16,73.15 | R4.2 41.66,72.64 42.16,73.15 | 42.16,73.15 v42.67,72.64 | v52.32,71.63 SJ6.1
  Bottom 0.305: v59.18,92.96 v62.48,92.96 | v42.67,72.64 51.31,72.64 v52.32,71.63
SWD_CLK[0]
  Top 0.406: U9.14 21.05,78.77 20.83,78.99 19.56,78.99 17.91,77.34 J1.2
SWD_IO[0]
  Top 0.406: U9.13 21.7,79.39 21.21,79.88 J1.1
UART_!RE!
  Top 0.305: 23.62,77.78 U9.10 23.65,79.43 24.08,79.86 30.23,79.86 32.96,77.12 43.44,77.12 44.04,77.72 TP21.1 45.06,77.83 45.33,77.83 47.19,79.69 47.19,81.43 46.23,82.4 35.05,82.4 33.27,84.18 TP30.1 33.27,86.87 33.02,87.12 33.02,88.82 U10.4
UART_DE
  Top 0.305: U9.9 24.3,78.91 24.64,79.25 29.97,79.25 32.71,76.51 43.69,76.51 44.14,76.96 TP22.1 45.06,77.07 45.43,77.07 47.8,79.44 47.8,81.68 46.48,83.01 35.31,83.01 34.04,84.28 TP31.1 34.04,86.87 34.24,87.07 U10.5
UART_RX
  Top 0.305: 31.75,88.31 U10.3 31.7,86.67 TP29.1 32.51,84.07 34.8,81.79 45.97,81.79 46.58,81.18 46.58,79.94 45.23,78.59 45.06,78.59 TP20.1 43.94,78.49 43.43,77.98 R3.2
  Top 0.406: U10.3 31.7,89.36
UART_TX  (via drill 0.35)
  Top 0.305: R5.2 TP11.1 45.82,80.11 v45.82,80.46 | U10.6 35.51,86.56 TP28.1 34.8,84.63 35.81,83.62 46.73,83.62 48.41,81.94 48.41,80.67 v48.56,80.52
  Top 0.406: 35.56,88.31 U10.6 35.51,88.19
  Bottom 0.305: v45.82,80.46 45.89,80.52 v48.56,80.52
USBM  (via drill 0.35)
  Top 0.305: v65.28,95 66.67,96.39 J4.USBM(8)
  Bottom 0.305: v65.28,95 57.15,95 55.37,96.77 54.1,96.77 53.33,97.54 51.69,97.54 J8.USBM(8)
USBP  (via drill 0.35)
  Top 0.305: v65.28,104.39 67.94,101.73 J4.USBP(7)
  Bottom 0.305: v65.28,104.39 54.23,104.39 J8.USBP(7)
XRES
  Top 0.305: U9.25 27.55,69.46 27.18,69.09 20.32,69.09 18.29,71.12 18.29,73.91 17.4,74.8 J1.3

### Text on the board
tPlace: EDGE | EDGE | EDGE | GND | GND | GND | GND | GND | 3V3 | RS485 | 24V | 5V | 3V3 | SCL | SDA | GND | 24V | RS485 Connection Pair w/UART Transceiver | Barrel Jack Connector Pair w/24V / Conditioning + Fuse + Indicator LED | I2C Header | RJ45 Connector Pair w/dI2C Buffer | GND | 5V | NC | GND | 24V | 3.3V | VIN | Enable | Enable | RS485 / Enable | RS485 | Fuse | EDGE | I2C-IN | I2C / Enable | Programming Header | I2C | GND | IO | SDA | SCL | GND | PSOC4100: 32-bit 24MHz / ARM-M0 Microcontroller | 5-26V to 3.3V@400mA Regulator / w/3v3 Enable, Indicator LED & Fuse | PSOC4100 Microcontroller / w/I2C or RS485 Communication | GND | 3V3 | I2C Connect | NC | GND | 24V-to-5V@1A Switching Regulator / w/Indicator LED + Enable | GND | LDAC | CLR | SCL | SDA | 3.3V | GND | PCA9685 Address Set | DAC5578 Address Set | 24V | 1+ | A5 | A4 | A3 | A2 | A1 | A0 | +RW | Default | 0x4c | 0x4a | 0x48 | LDAC / HW-EN | PCA9685: 16-Channel, / 12-bit FM+ I2C PWM Driver | DAC5578: 8-Channel, / 8-bit I2C DAC | GND | Light Controller v2.0 | EDGE | 6-Channel 24V, 700mA (per channel) Current Regulator Module w/I2C Controlled Dimming via PWM or Analog Signaling
bPlace: CH1 | CH2 | CH3 | CH4 | CH5 | CH6